# EAGLE board baseboard4 (EAGLE 4.15)
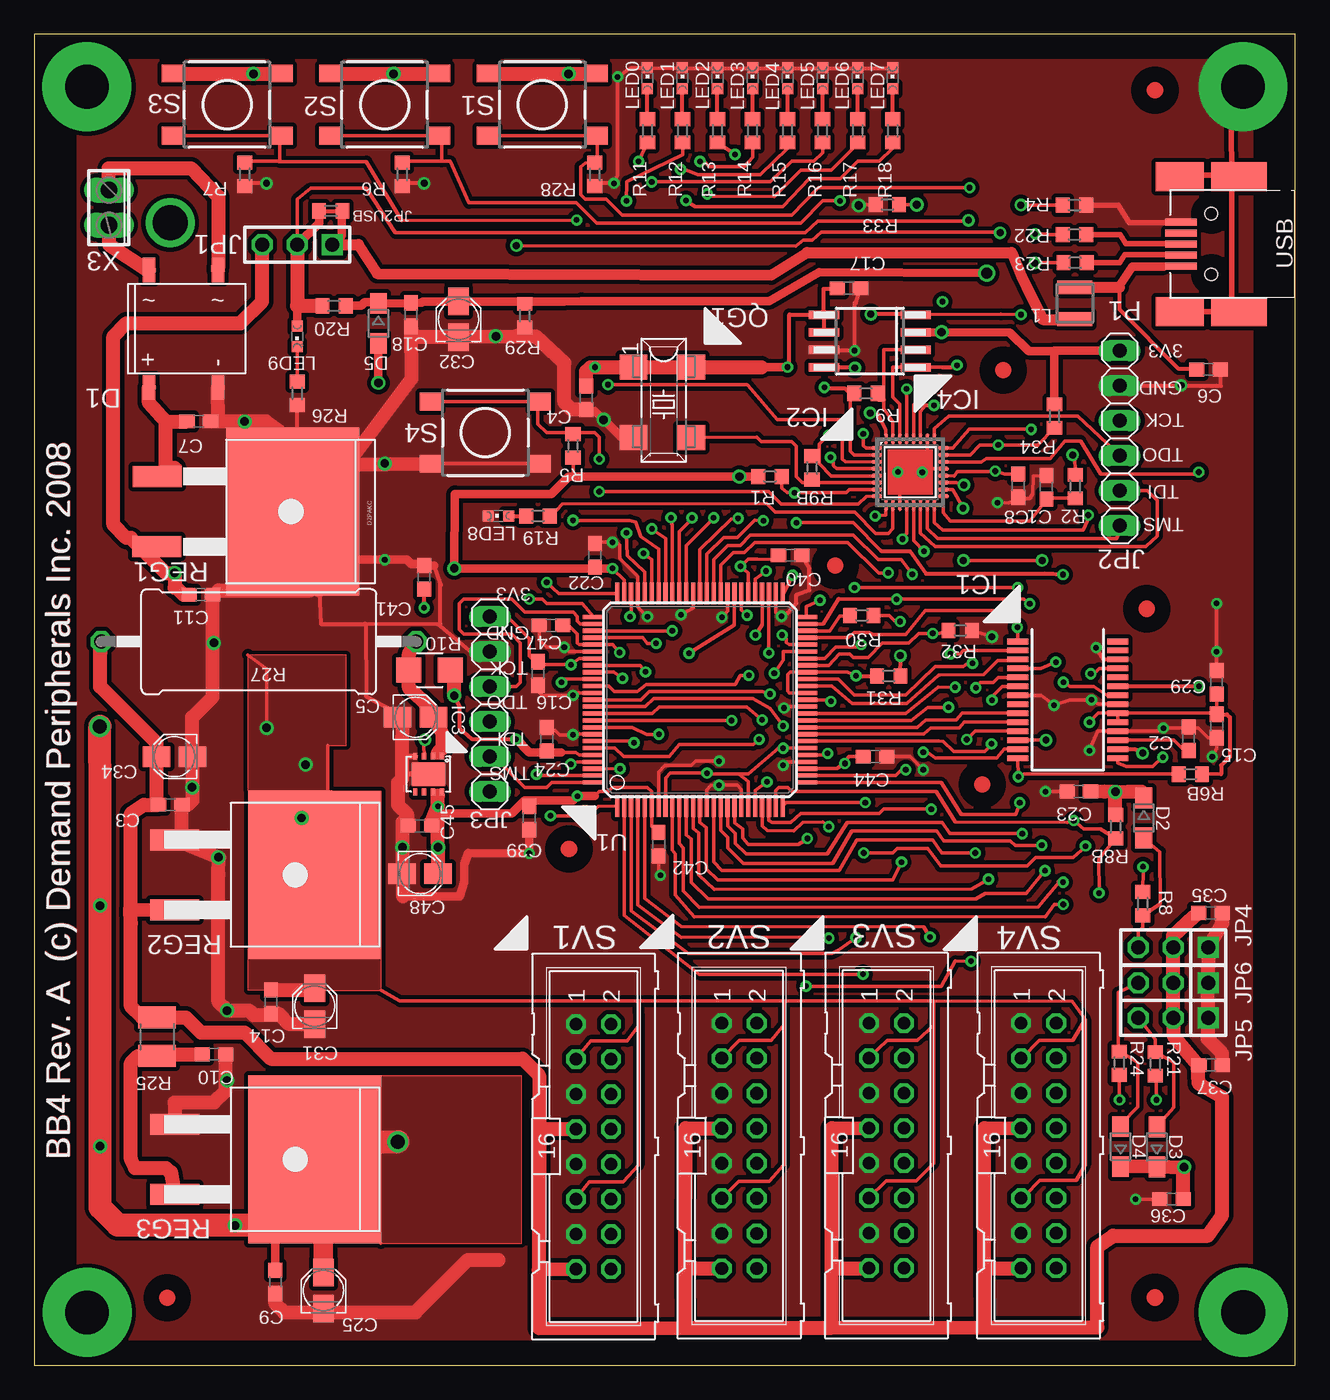
[diagram p3: board, top side]
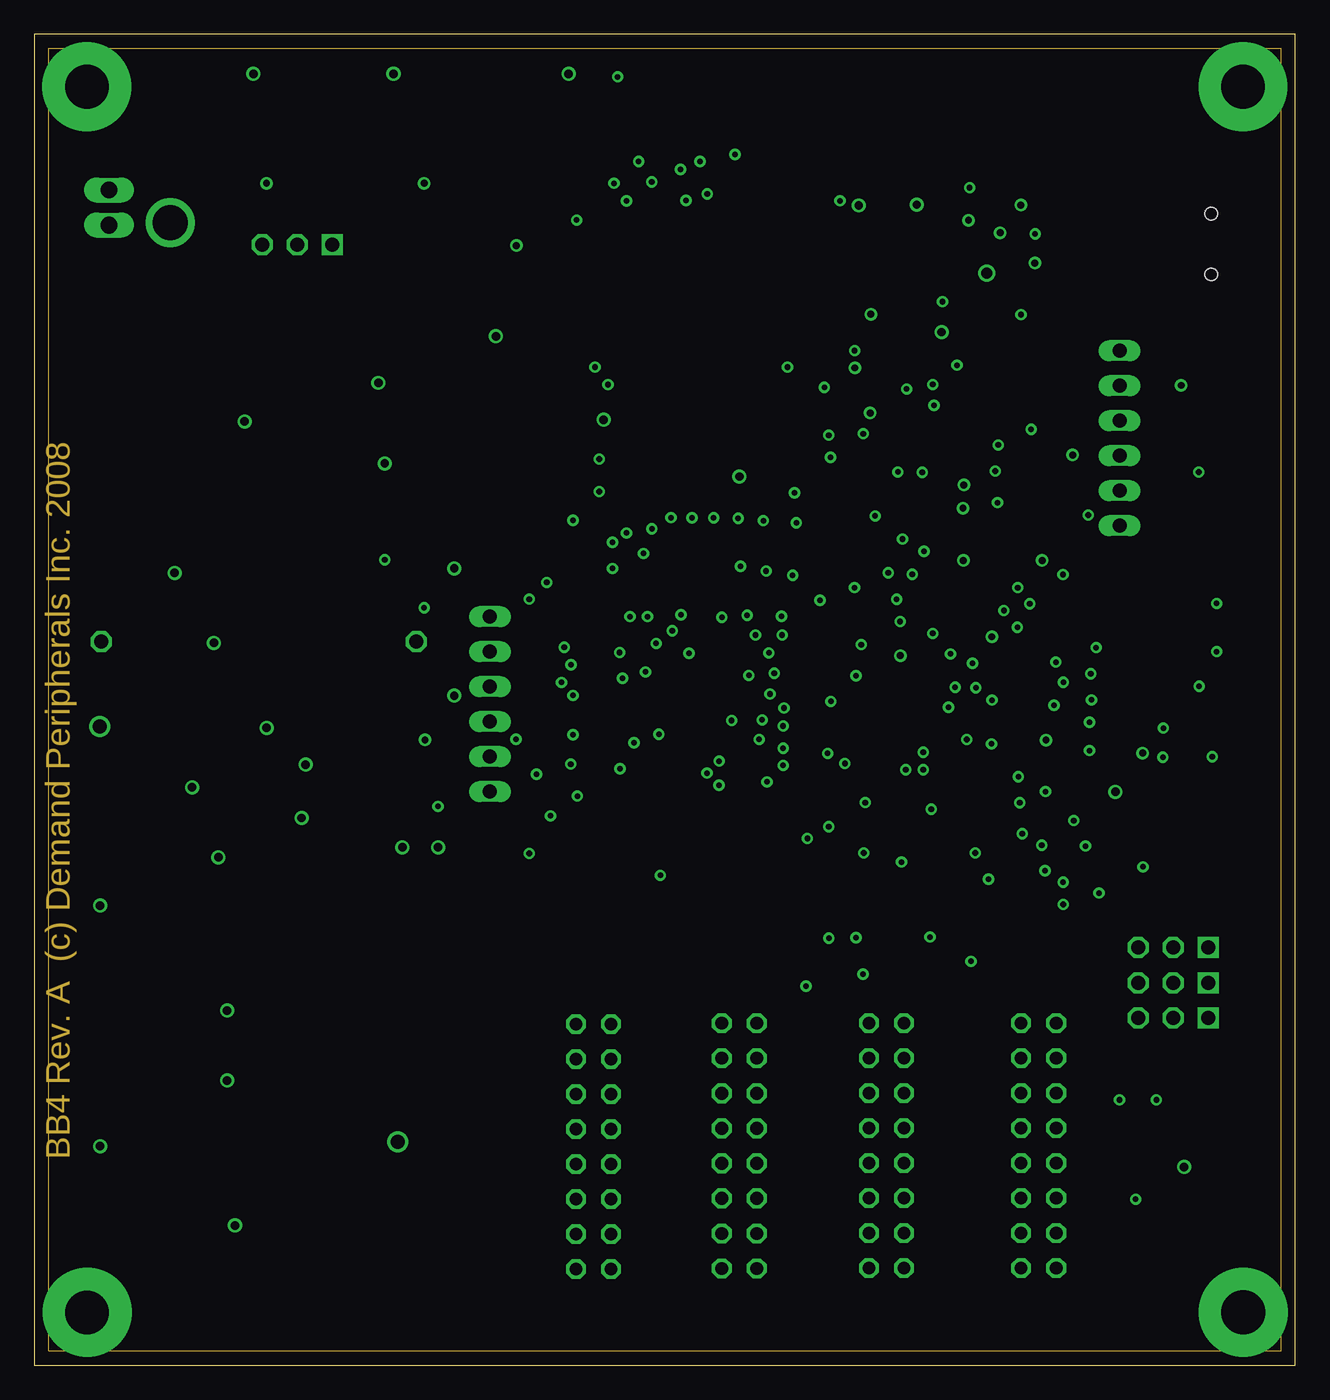
[diagram p4: board, inner layer $GND]
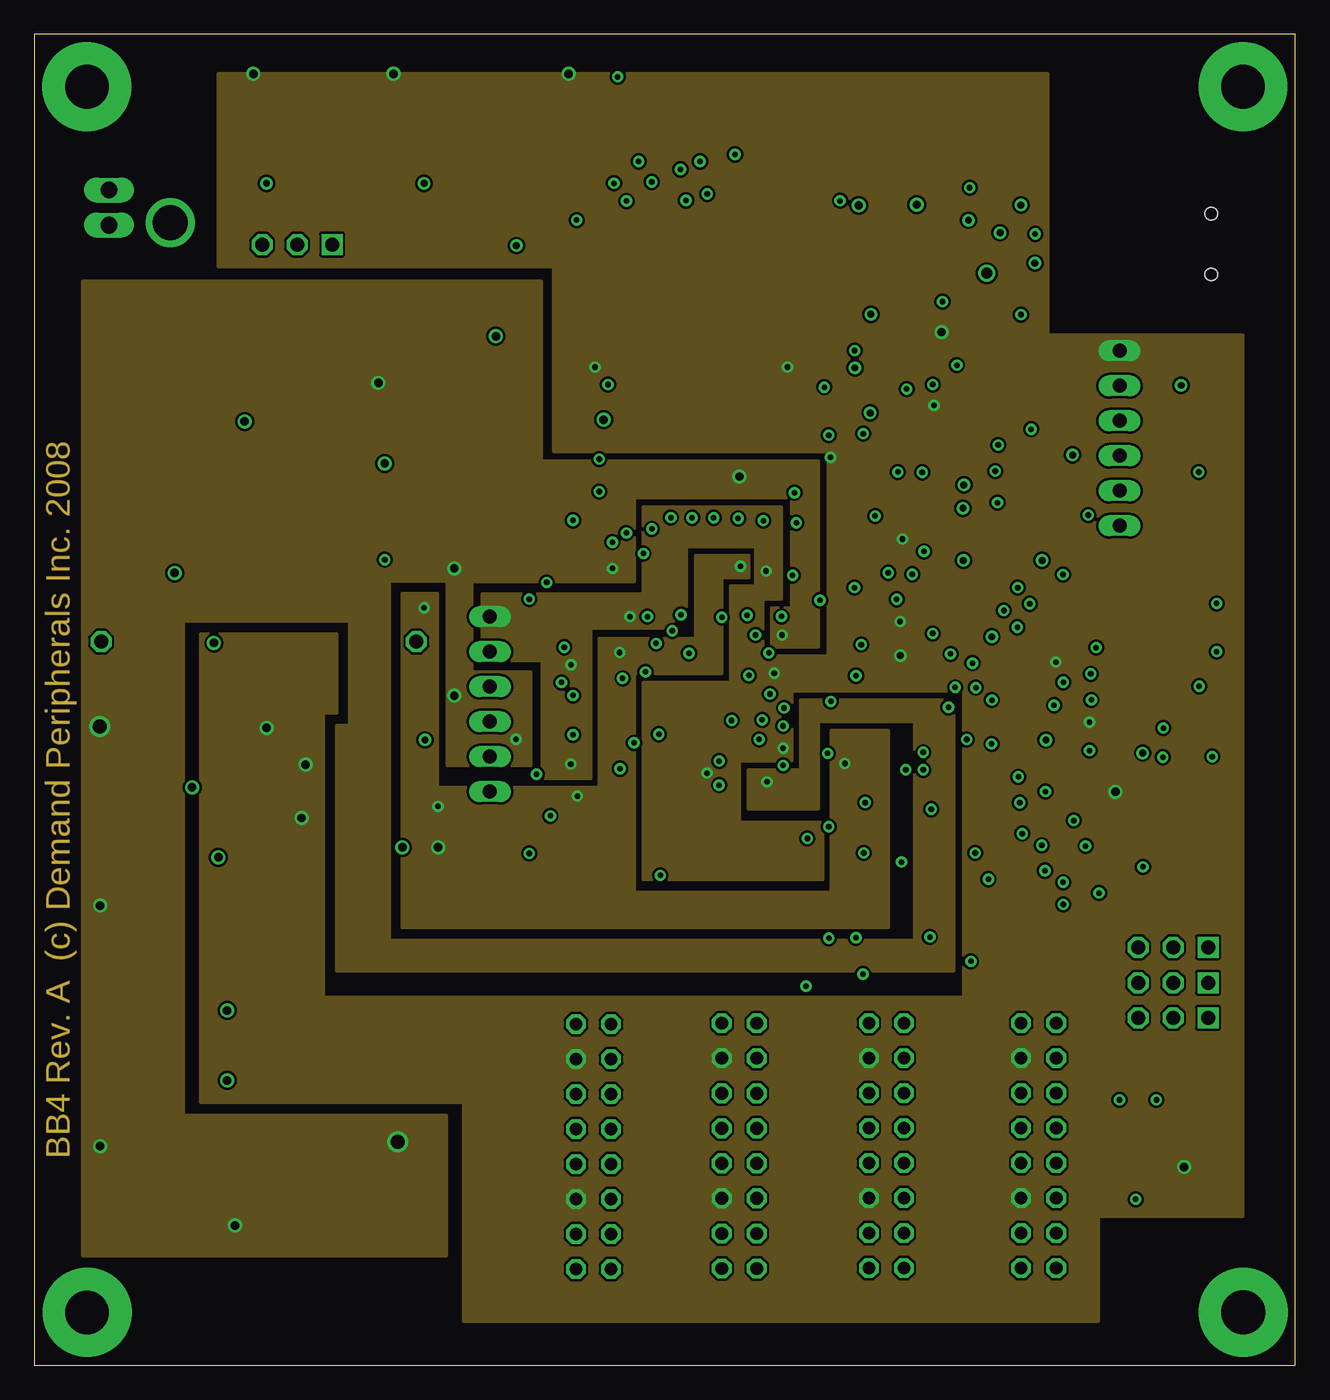
[diagram p5: board, inner layer Vxx]
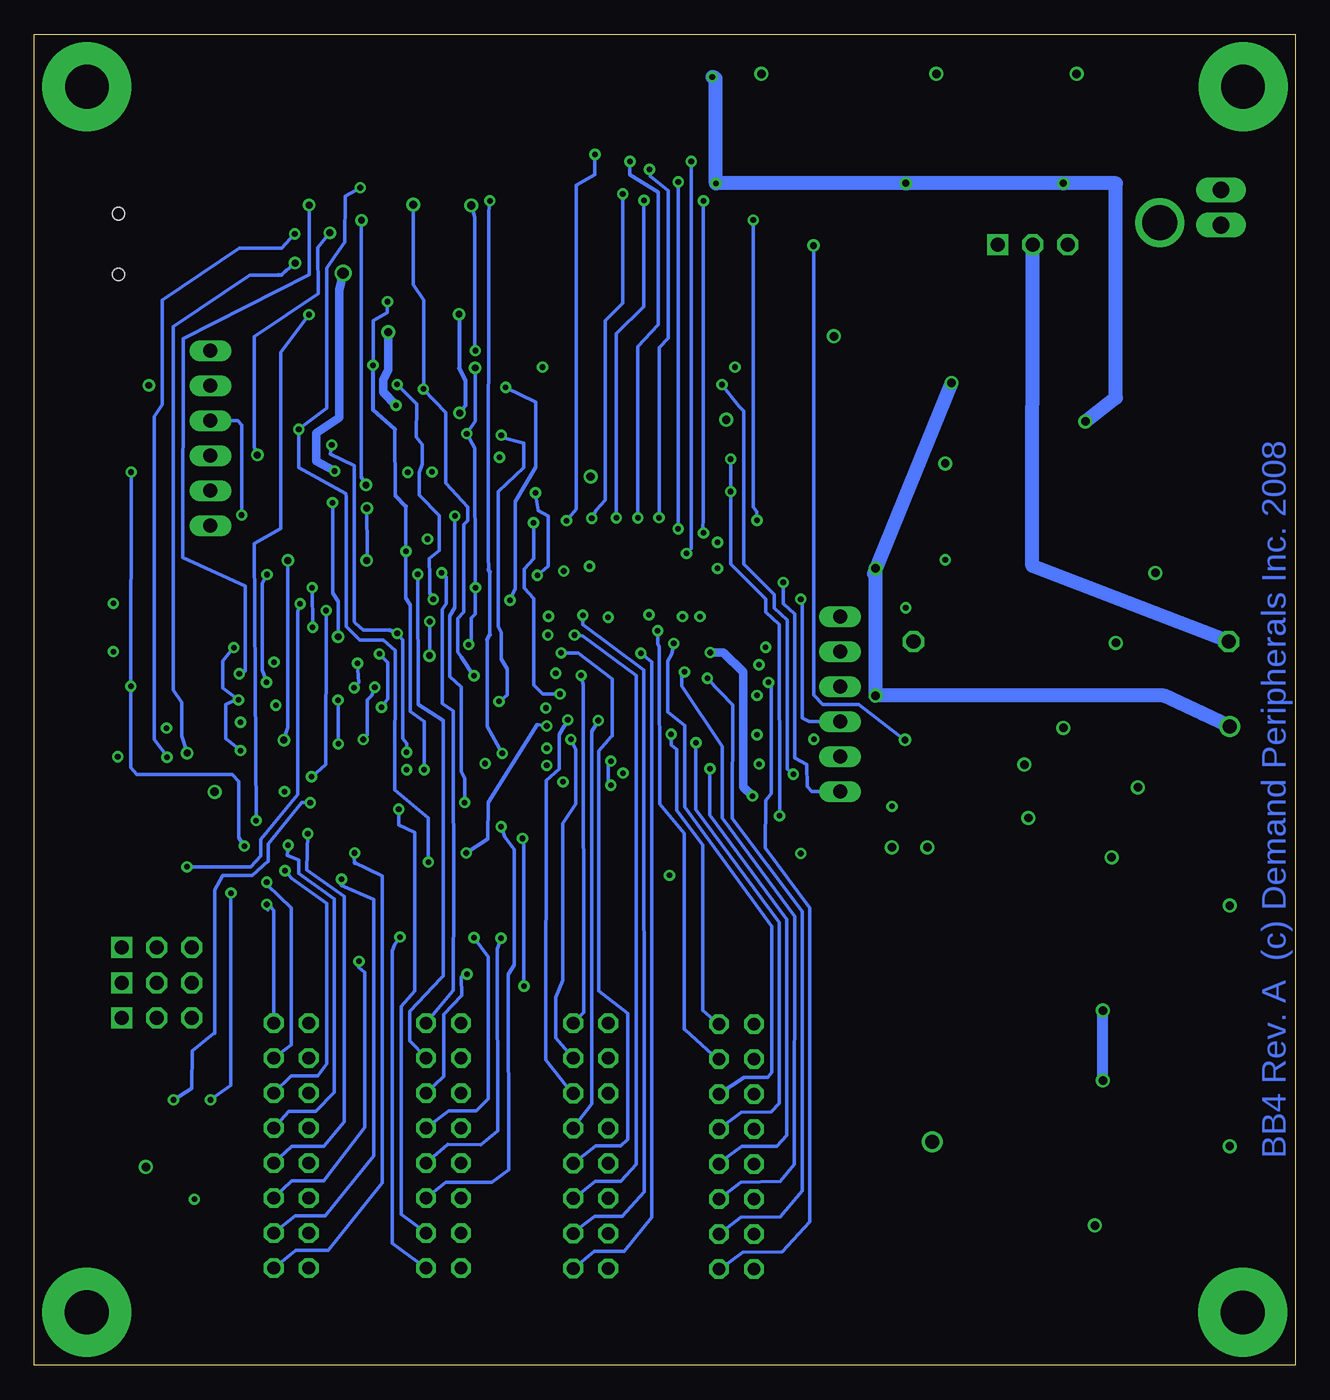
[diagram p6: board, bottom side, seen from below]

Size 91.44 x 96.52 mm. Coordinates in mm from the lower left corner, seen from the top.
Outline: 0,0 91.44,0 91.44,96.52 0,96.52 0,0
Copper layers (1*2+15*16): Top 0.035mm / dielectric 1.5mm / $GND 0.035mm / dielectric 0.15mm / Vxx 0.035mm / dielectric 0.2mm / Bottom 0.035mm
Design rules "M_BD2": minimum track width 10mil, minimum drill 16mil, track to track 7mil, track to pad 7mil, pad to pad 7mil, via to via 7mil, smd to smd 7mil, copper to edge 40mil, drill to drill 10mil, minimum pad ring 10mil, minimum via ring 8mil, stop-mask expansion 4mil, vias tented up to drill 0mil, thermal gap 10mil
tKeepout: area 0,0 to 3.2,96.5; area 88.3,0 to 91.4,96.5
bKeepout: area 0,0 to 3.2,96.5; area 88.3,0 to 91.4,96.5

## Footprints (pad centres in the part's own frame; a part is rotated, then mirrored left to right if it is on the bottom)
C0603 = smd 1.1 x 1: 1 -0.85,0; 2 0.85,0
PANASONIC_A = smd 2 x 1.5: + 1.3,0; - -1.3,0
DFS = smd 1.778 x 0.914: + -4,2.5; - -4,-2.5; ~1 4.5,2.5; ~2 4.5,-2.5
SOD323-W = smd 1.5 x 1.2: A 1.45,0; C -1.45,0
SSOP28C = smd 0.4 x 1.5: 1 -4.225,-3.625; 2 -3.575,-3.625; 3 -2.925,-3.625; 4 -2.275,-3.625; 5 -1.625,-3.625; 6 -0.975,-3.625; 7 -0.325,-3.625; 8 0.325,-3.625; 9 0.975,-3.625; 10 1.625,-3.625; 11 2.275,-3.625; 12 2.925,-3.625; 13 3.575,-3.625; 14 4.225,-3.625; 15 4.225,3.625; 16 3.575,3.625; 17 2.925,3.625; 18 2.275,3.625; 19 1.625,3.625; 20 0.975,3.625; 21 0.325,3.625; 22 -0.325,3.625; 23 -0.975,3.625; 24 -1.625,3.625; 25 -2.275,3.625; 26 -2.925,3.625; 27 -3.575,3.625; 28 -4.225,3.625
QFN32-ALT = smd 0.8 x 0.28: P$1 -2.41,1.75; P$2 -2.41,1.25; P$3 -2.41,0.75; P$4 -2.41,0.25; P$5 -2.41,-0.25; P$6 -2.41,-0.75; P$7 -2.41,-1.25; P$8 -2.41,-1.75; P$17 2.41,-1.75; P$18 2.41,-1.25; P$19 2.41,-0.75; P$20 2.41,-0.25; P$21 2.41,0.25; P$22 2.41,0.75; P$23 2.41,1.25; P$24 2.41,1.75 | smd 0.28 x 0.8: P$9 -1.75,-2.41; P$10 -1.25,-2.41; P$11 -0.75,-2.41; P$12 -0.25,-2.41; P$13 0.25,-2.41; P$14 0.75,-2.41; P$15 1.25,-2.41; P$16 1.75,-2.41; P$25 1.75,2.41; P$26 1.25,2.41; P$27 0.75,2.41; P$28 0.25,2.41; P$29 -0.25,2.41; P$30 -0.75,2.41; P$31 -1.25,2.41; P$32 -1.75,2.41
DFN-8B = smd 0.3 x 0.5: 1 -0.975,-1.3; 2 -0.325,-1.3; 3 0.325,-1.3; 4 0.975,-1.3; 5 0.975,1.3; 6 0.325,1.3; 7 -0.325,1.3; 8 -0.975,1.3 | smd 2.4 x 1.7: EP 0,0
SO-08M = smd 0.6 x 2.2: 1 -1.288,-3.578; 2 -0.018,-3.578; 3 1.252,-3.578; 4 2.522,-3.578; 5 2.522,3.083; 6 1.252,3.083; 7 -0.018,3.083; 8 -1.288,3.083
1X03 = drill 1.016 square: 1 -2.54,0 | drill 1.016 octagon: 2 0,0; 3 2.54,0
1X06 = drill 1.016 long: 1 -6.35,0; 2 -3.81,0; 3 -1.27,0; 4 1.27,0; 5 3.81,0; 6 6.35,0
R0603 = smd 1 x 1.1: 1 -0.85,0; 2 0.85,0
SM-NE29 = smd 1 x 2.54: 1 -1.15,0; 2 1.15,0
CHIPLED_0603 = smd 0.8 x 0.8: A 0,-0.75; C 0,0.75
MOLEXUSBRECEPT.0675031020 = smd 0.5 x 2.3: D+ 0,-6.2; D- 0.8,-6.2; GND -1.6,-6.2; ID -0.8,-6.2; VBUS 1.6,-6.2 | smd 2.1 x 4: PG -4.9,-2; PGC 4.9,-2 | smd 2.1 x 3.5: PGA -4.9,-6.3; PGB 4.9,-6.3 | hole 0.9: -2.2,-4; 2.2,-4
HC73 = smd 1.8 x 2: 1 0,-4.2; 2 5.1,-4.2; 3 5.1,0; 4 0,0
R1210W = smd 1.8 x 1.8: 1 -1.499,0; 2 1.499,0
R1210 = smd 1.6 x 2.7: 1 -1.4,0; 2 1.4,0
P0817/22 = drill 1.016 octagon: 1 -11.43,0; 2 11.43,0
D2PAKC = smd 12.192 x 9.652: GND 0,0 | smd 1.524 x 3.556: IP -2.54,-9.841; OP 2.54,-9.88
D2PAKB = smd 1.524 x 3.556: GND -2.54,-10.16; IP 2.54,-10.16 | smd 12.192 x 9.652: OUTPUT 0,0
DTSM-6 = smd 1.55 x 1.3: 1 -3.975,2.25; 2 3.975,2.25; 3 -3.975,-2.25; 4 3.975,-2.25
ML16 = drill 0.914 octagon: 1 -8.89,-1.27; 2 -8.89,1.27; 3 -6.35,-1.27; 4 -6.35,1.27; 5 -3.81,-1.27; 6 -3.81,1.27; 7 -1.27,-1.27; 8 -1.27,1.27; 9 1.27,-1.27; 10 1.27,1.27; 11 3.81,-1.27; 12 3.81,1.27; 13 6.35,-1.27; 14 6.35,1.27; 15 8.89,-1.27; 16 8.89,1.27
VQ100 = smd 1.6 x 0.3: P1 -7.7,6; P2 -7.7,5.5; P3 -7.7,5; P4 -7.7,4.5; P5 -7.7,4; P6 -7.7,3.5; P7 -7.7,3; P8 -7.7,2.5; P9 -7.7,2; P10 -7.7,1.5; P11 -7.7,1; P12 -7.7,0.5; P13 -7.7,0; P14 -7.7,-0.5; P15 -7.7,-1; P16 -7.7,-1.5; P17 -7.7,-2; P18 -7.7,-2.5; P19 -7.7,-3; P20 -7.7,-3.5; P21 -7.7,-4; P22 -7.7,-4.5; P23 -7.7,-5; P24 -7.7,-5.5; P25 -7.7,-6; P51 7.7,-6; P52 7.7,-5.5; P53 7.7,-5; P54 7.7,-4.5; P55 7.7,-4; P56 7.7,-3.5; P57 7.7,-3; P58 7.7,-2.5; P59 7.7,-2; P60 7.7,-1.5; P61 7.7,-1; P62 7.7,-0.5; P63 7.7,0; P64 7.7,0.5; P65 7.7,1; P66 7.7,1.5; P67 7.7,2; P68 7.7,2.5; P69 7.7,3; P70 7.7,3.5; P71 7.7,4; P72 7.7,4.5; P73 7.7,5; P74 7.7,5.5; P75 7.7,6 | smd 0.3 x 1.6: P26 -6,-7.7; P27 -5.5,-7.7; P28 -5,-7.7; P29 -4.5,-7.7; P30 -4,-7.7; P31 -3.5,-7.7; P32 -3,-7.7; P33 -2.5,-7.7; P34 -2,-7.7; P35 -1.5,-7.7; P36 -1,-7.7; P37 -0.5,-7.7; P38 0,-7.7; P39 0.5,-7.7; P40 1,-7.7; P41 1.5,-7.7; P42 2,-7.7; P43 2.5,-7.7; P44 3,-7.7; P45 3.5,-7.7; P46 4,-7.7; P47 4.5,-7.7; P48 5,-7.7; P49 5.5,-7.7; P50 6,-7.7; P76 6,7.7; P77 5.5,7.7; P78 5,7.7; P79 4.5,7.7; P80 4,7.7; P81 3.5,7.7; P82 3,7.7; P83 2.5,7.7; P84 2,7.7; P85 1.5,7.7; P86 1,7.7; P87 0.5,7.7; P88 0,7.7; P89 -0.5,7.7; P90 -1,7.7; P91 -1.5,7.7; P92 -2,7.7; P93 -2.5,7.7; P94 -3,7.7; P95 -3.5,7.7; P96 -4,7.7; P97 -4.5,7.7; P98 -5,7.7; P99 -5.5,7.7; P100 -6,7.7
2POL254 = drill 1.2 long: 1 -1.27,0; 2 1.27,0

## Placement (x,y rotation side)
C1  0.1uF  [C0603]  73.38,63.68 90 top
C2  0.033uF  [C0603]  83.69,45.43 90 top
C3  0.1uF  [C0603]  9.84,40.64 0 top
C4  0.1uF  [C0603]  40.01,70.17 270 top
C5  10uF  [PANASONIC_A]  27.62,46.99 0 top
C6  0.1uF  [C0603]  85.13,72.21 0 top
C7  0.1uF  [C0603]  11.91,68.45 0 top
C8  0.1uF  [C0603]  71.34,63.79 270 top
C9  0.1uF  [C0603]  17.46,6.03 270 top
C10  0.1uF  [C0603]  13.02,22.54 0 top
C11  0.1uF  [C0603]  12.06,55.88 0 top
C14  0.1uF  [C0603]  17.14,26.35 270 top
C15  0.1uF  [C0603]  85.72,46.35 270 top
C16  0.1uF  [C0603]  36.51,50.16 270 top
C17  0.1uF  [C0603]  59.05,78.11 0 top
C18  0.1uF  [C0603]  27.3,76.2 270 top
C22  0.1uF  [C0603]  40.64,58.74 90 top
C23  0.1uF  [C0603]  75.73,41.6 0 top
C24  0.1uF  [C0603]  37.15,45.4 90 top
C25  10uF  [PANASONIC_A]  20.95,5.4 90 top
C29  0.1uF  [C0603]  85.72,49.53 90 top
C31  10uF  [PANASONIC_A]  20.32,26.04 90 top
C32  10uF  [PANASONIC_A]  30.75,75.86 90 top
C34  10uF  [PANASONIC_A]  10.16,44.13 180 top
C35  0.1uF  [C0603]  85.29,32.79 0 top
C36  0.1uF  [C0603]  82.46,12.04 180 top
C37  0.1uF  [C0603]  85.29,21.76 0 top
C39  1.0uF  [C0603]  35.88,39.69 270 top
C40  0.1uF  [C0603]  54.8,58.74 0 top
C41  0.1uF  [C0603]  28.26,57.15 90 top
C42  0.1uF  [C0603]  45.26,37.78 270 top
C44  0.1uF  [C0603]  60.96,44.13 0 top
C45  0.1uF  [C0603]  27.95,39.12 180 top
C47  0.1uF  [C0603]  37.47,53.66 180 top
C48  10uF  [PANASONIC_A]  27.97,35.65 0 top
D1  L7805CD2T-TR  [DFS]  10.79,74.93 90 top
D2  SCHOTTKY  [SOD323-W]  80.44,39.69 270 top
D3  SCHOTTKY  [SOD323-W]  81.39,15.83 90 top
D4  SCHOTTKY  [SOD323-W]  78.76,15.84 90 top
D5  SD101AWS  [SOD323-W]  24.94,75.56 270 top
IC1  FT245RLSSOP-28  [SSOP28C]  74.93,48.26 270 top
IC2  XC2C32A-QFG32MOD_QFN32  [QFN32-ALT]  63.5,64.77 0 top
IC3  MCP1726  [DFN-8B]  28.57,42.86 180 top
IC4  AT45DB041D-SU  [SO-08M]  60.33,73.66 90 top
JP1  1x3 SIL  [1X03]  19.05,81.28 180 top
JP2  1x6 SIL  [1X06]  78.69,67.23 90 top
JP2USB  Cut4EXT  [R0603]  21.49,83.72 180 top
JP3  1x6 SIL  [1X06]  33.02,47.94 90 top
JP4  1x3 SIL  [1X03]  82.57,30.3 180 top
JP5  1x3 SIL  [1X03]  82.57,25.19 180 top
JP6  1x3 SIL  [1X03]  82.57,27.72 180 top
L1  Ferrite 500mA  [SM-NE29]  75.45,77.03 90 top
LED0  RED  [CHIPLED_0603]  44.45,93.34 0 top
LED1  RED  [CHIPLED_0603]  46.99,93.34 0 top
LED2  RED  [CHIPLED_0603]  49.53,93.34 0 top
LED3  RED  [CHIPLED_0603]  52.07,93.34 0 top
LED4  RED  [CHIPLED_0603]  54.61,93.34 0 top
LED5  RED  [CHIPLED_0603]  57.15,93.34 0 top
LED6  RED  [CHIPLED_0603]  59.69,93.34 0 top
LED7  RED  [CHIPLED_0603]  62.23,93.34 0 top
LED8  GREEN  [CHIPLED_0603]  33.66,61.59 90 top
LED9  RED  [CHIPLED_0603]  19.05,74.61 180 top
P1  USBRECEPTACLE  [MOLEXUSBRECEPT.0675031020]  89.34,81.32 270 top
QG1  50MHz  [HC73]  47.62,72.39 270 top
R1  330R  [R0603]  53.34,64.45 180 top
R2  1K0  [R0603]  75.46,63.73 270 top
R4  0R  [R0603]  75.41,84.14 180 top
R5  4K7  [R0603]  39.05,66.67 270 top
R6  10K  [R0603]  26.67,86.36 270 top
R6B  10K  [R0603]  83.82,42.86 0 top
R7  10K  [R0603]  15.24,86.36 270 top
R8  180R  [R0603]  80.37,33.47 270 top
R8B  4K7  [R0603]  78.4,39.04 90 top
R9  0R  [R0603]  60.3,70.48 180 top
R9B  0R  [R0603]  56.39,65.09 270 top
R10  1R0  [R1210W]  28.65,50.42 0 top
R11  180R  [R0603]  44.45,89.53 90 top
R12  180R  [R0603]  46.99,89.53 90 top
R13  180R  [R0603]  49.53,89.53 90 top
R14  180R  [R0603]  52.07,89.53 90 top
R15  180R  [R0603]  54.61,89.53 90 top
R16  180R  [R0603]  57.15,89.53 90 top
R17  180R  [R0603]  59.69,89.53 90 top
R18  180R  [R0603]  62.23,89.53 90 top
R19  180R  [R0603]  36.51,61.59 180 top
R20  1K5  [R0603]  21.73,76.83 0 top
R21  180R  [R0603]  81.28,21.84 90 top
R22  27R  [R0603]  75.41,82 180 top
R23  27R  [R0603]  75.46,79.97 0 top
R24  180R  [R0603]  78.66,21.89 90 top
R25  5R6 0.5W  [R1210]  8.89,23.81 270 top
R26  180R  [R0603]  19.05,70.48 90 top
R27  3R3 2W  [P0817/22]  16.27,52.48 0 top
R28  10K  [R0603]  40.64,86.36 270 top
R29  180R  [R0603]  35.56,76.12 90 top
R30  10K  [R0603]  59.99,54.38 0 top
R31  10K  [R0603]  61.95,49.99 0 top
R32  10K  [R0603]  67.13,53.29 0 top
R33  10K  [R0603]  61.85,84.18 0 top
R34  10K  [R0603]  73.96,68.83 90 top
REG1  [D2PAKC]  18.73,61.91 270 top
REG2  [D2PAKB]  20.32,35.56 270 top
REG3  [D2PAKB]  20.32,14.92 270 top
S1  DTSM-6  [DTSM-6]  36.83,91.44 0 top
S2  DTSM-6  [DTSM-6]  25.4,91.44 0 top
S3  DTSM-6  [DTSM-6]  13.97,91.44 0 top
S4  DTSM-6  [DTSM-6]  32.7,67.63 180 top
SV1  [ML16]  40.54,15.85 270 top
SV2  [ML16]  51.1,15.9 270 top
SV3  [ML16]  61.77,15.93 270 top
SV4  [ML16]  72.82,15.93 270 top
U1  XC3S100EVQ100  [VQ100]  48.26,48.26 90 top
U$3  [FIDUCIAL]  9.63,4.89 0 top
U$16  [FIDUCIAL]  81.26,4.9 0 top
U$23  [FIDUCIAL]  81.26,92.48 0 top
U$30  [FIDUCIAL]  38.76,37.44 0 top
U$31  [FIDUCIAL]  70.26,72.16 0 top
U$32  [FIDUCIAL]  58.06,57.99 0 top
U$34  [FIDUCIAL]  68.73,42.11 0 top
U$35  [FIDUCIAL]  80.67,54.86 0 top
U$37  [FIDUCIAL]  80.67,54.86 0 top
X3  2 pos  [2POL254]  5.4,83.96 270 top

## Tracks (layer width: path | path; a pad name or v marks a point on that pad's centre or on a via)
50MHZ
  Top 0.254: QG1.3 52.39,67.31 52.7,66.99 54.93,66.99 55.24,66.67 55.24,64.45 55.68,64.02 56.52,64.02 | 56.52,64.02 IC2.P$6 | 56.52,64.02 R9B.2
+1V2  (via drill 0.41, 0.61)
  Top 0.254: 40.64,41.27 40.96,41.59 41.59,41.59 41.91,41.91 44.45,41.91 44.76,41.6 U1.P6 44.76,40.33 44.77,40.32 44.77,39.05 45.19,38.63 C42.1 | 39.05,40.96 v39.37,41.27 | U1.P56 51.76,57.46 v51.2,57.94 51.77,58.45 52.43,58.45 54.23,58.45 | C47.1 38.73,53.66 39.37,53.02 39.37,52.39 39.5,52.26 U1.P80 41.92,52.28 42.46,51.67 v42.43,51.69 | U1.P28 58.18,43.26 v58.76,43.64 59.05,44.13 C44.1 | 29.57,41.56 IC3.8 29.52,41.56 | 29.55,40.51 v29.26,40.53 29.22,40.52 29.52,41.56 | 29.52,41.56 IC3.7
  Top 0.305: v29.26,40.53 29.84,40.01 | v28.26,54.93 C41.1 | 54.18,58.45 C40.1 54.23,58.45
  Top 0.61: v39.37,41.27 40.64,41.27 | 35.88,40.96 35.56,40.96 34.61,40.01 29.84,40.01 | 35.88,40.96 39.05,40.96 | 35.88,40.96 C39.1
  Top 1.016: C48.+ 29.24,39.98 29.21,40.01 C45.1 28.8,39.42 v29.26,40.53 29.26,41.31
  Bottom 0.61: v42.43,51.69 41.51,51.69 40.06,50.27 40.05,41.94 40.06,41.94 v39.37,41.27
  other vias: 29.27,37.55
  pour Vxx (no thermals): 29.2,55.98 26.67,55.98 26.67,31.75 61.91,31.75 61.91,46.04 57.78,46.04 57.78,34.29 43.5,34.29 43.5,50.16 49.85,50.16 49.85,57.12 51.8,57.12 51.8,58.74 47.94,58.74 47.94,52.7 40.96,52.7 40.96,41.91 29.2,41.91
+1V8  (via drill 0.41, 0.81)
  Top 0.254: IC2.P$20 66.7,64.49 66.92,64.82 69.22,64.82 v69.67,64.85 70.36,64.64 71.4,64.64 C8.1 71.37,64.57
  Top 0.61: 38.42,77.14 39.66,77.19 53.29,77.19 56.9,79.27 v69.06,79.2 | R20.2 22.68,76.81 | R20.2 22.53,76.83 | R20.2 23.7,76.83 23.95,77.09 24.92,77.09 D5.C 27.33,77.01 C18.1 28.09,77.06 28.17,77.14 30.76,77.14 C32.+ 35.59,77.14 | 35.59,77.14 R29.2 | 35.59,77.14 38.42,77.14 | 38.42,77.14 38.43,77.14
  Bottom 0.61: v69.06,79.2 69.33,77.99 69.33,68.75 71.02,67.6 70.99,65.58 v69.67,64.85
+2V5  (via drill 0.41, 0.6, 0.61, 1.02)
  Top 0: 25.12,8.84 35.33,8.82 35.33,21.01 25.09,21.01 25.12,8.84
  Top 0.254: U1.P21 52.26,41.68 v53.12,42.3 | 39.05,64.45 R5.2 | C22.1 42.12,57.89 v41.91,57.78 42.76,56.94 U1.P74 | REG3.OUTPUT 23.5,14.92 23.5,16.19 | 20.95,9.84 24.13,9.84 25.12,8.84 | U1.P46 54.74,52.26 54.53,52.41 54.53,52.69 v54.22,52.96 | 38.2,44.45 39.24,44.45 39.49,44.27 40.45,44.27 U1.P96
  Top 0.305: v30.44,48.55 30.82,47.71 30.81,47.73 30.81,46.23 31.7,45.41 v34.92,45.4 | 37.15,44.45 C24.1
  Top 0.61: 38.2,44.45 37.15,44.45 35.88,44.45 v34.92,45.4 | v41.91,57.78 v30.44,57.78 30.47,63.12 30.48,63.18 37.47,63.18 38.73,64.45 39.05,64.45 v51.12,64.45 R1.2 | 16.51,10.16 17.46,10.16 17.46,9.84 | 17.46,9.84 20.95,9.84 | 17.46,9.84 C9.1 | v24.94,71.25 D5.A
  Top 1.016: R10.2 30.43,50.14 v30.44,48.55
  Top 1.422: 20.95,9.84 C25.+
  Top 1.676: v4.75,46.32 4.76,40.96 v4.76,33.34 v4.76,15.88 4.76,11.43 6.03,10.16 16.51,10.16 | 23.5,16.19 v26.35,16.19
  Bottom 1.016: v4.75,46.32 6.75,47.26 9.54,48.55 v30.44,48.55 v30.44,57.78 30.56,57.4 v24.94,71.25
  other vias: 14.54,10.12
  pour Top (no thermals): 25.11,8.97 35.19,8.97 35.19,20.88 25.08,20.88
  pour Vxx (no thermals): 29.95,56.86 29.92,43.5 35.99,43.5 35.99,50.28 31.71,50.28 31.71,56.83 43.5,56.83 43.5,62.94 54.93,62.94 54.93,54.93 53.48,54.93 53.48,52.07 56.83,52.07 56.83,65.58 36.77,65.58 36.74,78.61 3.49,78.61 3.49,7.94 29.84,7.94 29.84,18.1 10.79,18.1 10.79,53.98 25.72,53.98 25.72,56.86
  pour Vxx (no thermals): 51.75,40.32 51.75,43.18 55.56,43.18 55.56,48.26 66.66,48.26 66.66,28.6 21.91,28.57 21.91,46.39 22.86,46.39 22.86,53.98 25.72,53.98 25.72,30.8 63.82,30.8 63.82,46.67 56.83,46.67 56.83,40.32
+3V3  (via drill 0.41, 0.5, 0.61)
  Top 0: 21.27,44.96 22.59,44.96 22.59,51.51 15.48,51.51 15.48,41.72 21.59,41.67 | 15.49,30.18 15.49,27.19 17.09,27.18 | 17.09,27.18 25.14,27.19 25.14,29.66 | C14.1 17.09,27.18
  Top 0.254: U1.P97 40.59,43.76 40.64,43.75 39.34,43.75 v38.89,43.6 | U1.P45 54.3,51.76 54.29,51.13 v53.65,50.18 | U1.P31 54.3,44.76 v54.29,44.74 | U1.P73 43.26,54.69 v43.18,54.29 | U1.P8 45.76,42.59 46.12,42.94 v48.77,42.94 48.94,42.89 51.1,42.89 | U1.P82 39.51,51.26 v38.9,50.8 36.83,50.8 | U1.P55 52.26,57.02 v53.06,57.59 | JP3.6 34.29,54.29 35.88,52.7 35.88,51.44 36.2,51.12 36.52,51.1 C16.1 | 21.27,44.96 21.27,35.24 20.32,34.29 | v16.83,46.23 16.83,50.48 15.48,51.51 | 78.42,47.31 78.44,47.28 IC1.20 78.56,46.86 78.74,46.67 78.7,46.63 IC1.19 | 78.42,47.31 85.41,47.31 | IC1.4 72.97,50.53 v74.07,50.99 | 78.42,47.31 77.15,47.31 v76.5,46.63 | 86.04,42.86 R6B.2 | 64.62,69.62 64.25,69.16 64.25,67.82 IC2.P$27 | IC2.P$12 63.25,61.53 63.25,60.3 v62.94,59.92 | 57.91,65.85 57.91,65.28 57.97,65.2 58.18,65.02 IC2.P$4 | v62.78,53.94 62.43,53.95 62,54.38 R30.2 | C4.1 39.69,70.8 | C15.1 C29.1 | 58.26,78.08 C17.1 | 53.97,44.76 51.77,42.89 51.1,42.89 | U1.P20 51.77,42.34 51.1,42.84 51.1,42.89 | 25.14,27.19 26.5,26.41 43.8,26.41 | 43.8,26.41 54.34,26.41 | 54.34,26.41 65.21,26.41 | 65.21,26.41 75.25,26.38 76.19,25.08 | 76.19,25.08 76.19,14.54 75.55,13.4 72.89,13.4 71.86,12.32 SV4.11 | 76.19,25.08 75.31,23.55 72.85,23.55 71.6,22.24 SV4.3 | SV3.11 61.77,13.37 63.94,13.37 65.21,14.65 65.21,24.63 | SV3.3 61.82,23.55 64.01,23.56 65.21,24.63 | SV2.11 51.07,13.34 53.27,13.34 54.34,14.54 54.34,24.52 | 54.34,24.52 54.34,24.97 54.34,26.39 54.34,26.41 | SV2.3 51.12,23.56 53.42,23.56 54.23,24.52 54.34,24.52 | SV1.11 40.25,13.28 42.71,13.28 43.8,14.54 43.8,24.63 | SV1.3 40.33,23.5 42.99,23.5 43.8,24.63 | 65.21,24.63 65.21,24.97 65.21,26.36 65.21,26.41
  Top 0.254: 43.8,26.41 43.8,26.33 43.8,24.63
  Top 0.305: 53.97,44.76 54.3,44.76 | 86.04,42.86 86.04,43.5 86.68,44.13 86.68,46.99 86.46,47.2 85.64,47.21 C15.1 85.68,47.12 85.41,47.31 | 17.78,93.66 18.1,93.66 | 64.62,69.62 v65.23,69.62 | v57.72,65.85 57.91,65.85 | IC4.5 57.23,78.08 58.26,78.08 | v54.61,72.39 54.74,72.52 54.74,76.2 57.3,76.2 IC4.5 | IC4.6 57.23,74.75 IC4.5 | R30.2 61.04,54.36 | v62.79,51.46 62.81,51.44 R31.2
  Top 0.406: 73.94,69.65 R34.2 | 73.94,73.56 73.94,73.58 | 64.08,74.91 IC4.3
  Top 0.61: 52.7,72.39 v54.61,72.39 | 73.94,73.58 JP2.6 | 73.94,69.65 73.94,73.56 72.08,73.56 70.74,74.91 v65.79,74.93 64.08,74.91
  Top 1.016: 52.7,72.39 QG1.4 QG1.1 v40.64,72.39 40.32,72.39 40.01,72.07 C4.1 | 20.32,34.29 23.18,31.43 | S3.2 17.81,93.69 17.78,93.66 | S1.2 38.76,93.69 v38.73,93.66 33.02,93.66 32.99,93.69 S1.1 | 29.21,93.66 29.24,93.69 S2.2 26.06,93.69 v26.04,93.66 21.27,93.66 21.3,93.69 S2.1 | 18.1,93.66 S3.2 | 17.78,93.66 17.92,93.66 S3.2 | 17.78,93.66 v15.88,93.66 10.02,93.66 S3.1 | D4.C 81.45,14.4 D3.C 83.3,14.31 | 83.3,14.31 v83.36,14.37 | v78.39,41.59 78.4,41.57 77.58,41.59 76.55,41.59 C23.2 | R8B.2 78.38,39.93 v78.39,41.59 | v78.39,41.59 79.32,41.59 80.27,41.59 D2.C | C14.1 20.32,27.2 C31.+ | C36.1 83.29,12.07 83.3,14.31
  Bottom 0.254: v62.78,53.94 62.79,53.75 v62.79,51.46
  Bottom 0.61: 65.79,75.03 v65.79,74.93 65.79,72.16 66.14,71.48 66.14,70.56 65.25,69.62 v65.23,69.62
  other vias: 19.37,39.69 19.66,43.56
  pour Top (no thermals): 21.27,41.59 21.27,45.09 22.47,45.09 22.47,51.38 15.61,51.38 15.61,41.59
  pour Top (no thermals): 15.62,27.3 15.62,29.53 25.02,29.53 25.02,27.3
  pour Vxx (no thermals): 21.91,53.02 12.06,53.02 12.06,19.05 31.11,19.05 31.11,3.17 77.15,3.17 77.15,10.79 87.63,10.79 87.63,74.7 73.48,74.7 73.48,93.66 13.34,93.66 13.31,79.69 37.64,79.69 37.67,66.28 57.57,66.28 57.54,51.44 52.82,51.44 52.82,55.56 54.17,55.56 54.17,62.23 44.13,62.23 44.13,55.92 32.49,55.92 32.49,51.12 36.83,51.12 36.83,42.55 40.32,42.55 40.32,53.47 47.26,53.47 47.26,59.37 52.31,59.37 52.31,56.52 50.48,56.52 50.48,49.53 44.13,49.53 44.13,35.24 57.15,35.24 57.15,39.37 51.12,39.37 51.12,43.81 54.93,43.81 54.93,48.9 67.39,48.9 67.39,26.67 20.95,26.67 20.95,47.31 21.91,47.31
+5V_EXT  (via drill 0.61)
  Top 0.254: 10.16,56.2 10.16,56.4 10.28,56.4
  Top 0.61: REG1.OP 7.62,59.37 6.99,60.01
  Top 1.016: C11.1 10.79,55.88 10.28,56.4 | JP1.3 16.51,77.15 14.92,75.56 6.67,75.56 5.71,74.61 5.71,60.96 6.67,60.01 6.99,60.01 9.53,57.47 v10.16,57.47 10.16,56.4
+5V_USB
  Top 0.406: 75.34,75.84 L1.1
  Top 0.61: JP1.1 22.28,81.92 22.28,82.93 22.33,83.67 JP2USB.1
  Top 0.813: JP1.1 23.48,81.28 24.85,79.17 53.44,79.07 56.03,80.71 70.87,80.71 71.56,78.99 71.92,78.26 73.11,75.84 75.34,75.84
AGND  (via drill 0.41, 0.5)
  Top 0.254: IC1.25 77.2,50.53 76.83,50.16 v76.59,50.14 | R4.2 74.57,84.15 v71.53,84.15
  Bottom 0.254: v71.53,84.15 71.53,79.1 80.67,74.47 80.68,58.59 76.16,56.5 76.17,50.34 v76.59,50.14 76.17,50.37
CCLK  (via drill 0.41)
  Top 0.254: v57.28,70.93 57.61,70.85 | U1.P50 55.96,55.01 v56.96,55.47 | 59.16,70.1 59.16,66.34 59.16,66.28 59.44,66.02 IC2.P$2
  Top 0.305: v57.28,70.93 57.34,70.87 58.75,70.87 59.16,70.46 59.16,70.1 59.44,70.1 R9.2
  Bottom 0.254: 57.28,70.92 55.09,69.85 55.09,65.13 56.57,62.64 56.57,56.33 56.99,55.44 v56.96,55.47
  Bottom 0.305: 57.28,70.92 v57.28,70.93
CCLK_FLASH
  Top 0.254: IC2.P$31 62.26,68.45 61.57,69.39 61.59,69.41 61.59,70 61.59,73.66 63.82,73.66
  Top 0.305: 61.59,70 61.21,70 R9.1 | 63.82,73.66 IC4.2 63.88,73.66 63.82,73.66
D0  (via drill 0.41, 0.5 pad 0.25)
  Top 0.254: U1.P44 57.29,51.26 58.1,52.07 59.69,52.07 v59.96,52.26 | v60.1,67.56 60.1,66.69 60.33,66.52 IC2.P$1 | IC1.1 71.31,53.16 v71.27,53.52 | v59.47,56.4 v71.3,56.4
  Top 0.305: IC4.8 57.32,72.37 57.33,72.36 v59.49,72.34
  Bottom 0.254: v59.96,52.26 59.78,52.61 59.78,54.2 59.5,54.49 v59.47,56.4 59.5,66.51 v60.1,67.56 59.49,68.48 v59.49,72.34 | v71.3,56.4 v71.27,53.52
D1  (via drill 0.41)
  Top 0.254: v68.02,50.91 67.64,50.89 67.35,50.66 65.33,50.66 63.2,48.62 59.44,48.62 58.29,49.76 U1.P41 | IC1.5 69.89,49.88 69.53,49.53 68.58,49.53 v68.26,49.14
  Bottom 0.254: v68.26,49.14 67.94,49.53 v68.02,50.91
D2
  Top 0.254: IC1.3 71.19,51.19 71.12,51.12 69.85,51.12 68.83,50.08 65.66,50.07 65.58,50.06 63.25,47.98 59.31,47.98 57.81,49.25 U1.P40
D3  (via drill 0.41)
  Top 0.254: U1.P36 63.2,47.26 65.55,49.19 v66.76,49.16 | IC1.11 68.21,45.98 v67.6,45.38
  Bottom 0.254: v66.76,49.16 66.99,48.58 67.31,48.26 67.31,45.72 v67.6,45.38
D4  (via drill 0.41)
  Top 0.254: U1.P35 63.59,46.76 64.77,47.71 v66.28,47.71 | IC1.2 68.81,51.84 68.76,51.84 67.36,51.84 67.13,51.59 v66.43,51.59
  Bottom 0.254: v66.28,47.71 65.81,48.31 65.81,50.97 v66.43,51.59
D5
  Top 0.254: U1.P34 64.02,46.26 64.62,46.79 66.84,46.79 67.29,47.28 IC1.9
D6
  Top 0.254: U1.P33 64.49,45.76 64.99,46.2 67.06,46.2 67.44,46.63 IC1.10
D7  (via drill 0.41)
  Top 0.254: U1.P32 65.58,45.26 65.9,45.23 66.67,44.52 68.91,44.52 v69.41,45.06 | IC1.6 70.19,49.23 69.22,48.26 v69.43,48.23
  Bottom 0.254: v69.41,45.06 v69.43,48.23
DONEFPGA  (via drill 0.41)
  Top 0.254: IC2.P$7 59.08,63.52 58.86,63.28 v55.12,63.28 54.58,63.28 54.19,63.6 R1.1 | U1.P51 54.26,55.86 54.98,57.26 v54.98,57.29
  Bottom 0.254: v55.12,63.28 54.93,61.98 54.17,61.59 54.17,57.95 v54.98,57.28 v54.98,57.29
GND  (via drill 0.41, 0.5, 0.5 pad 0.81, 0.6, 0.61, 3.17 pad 6.45)
  Top 0.254: U1.P87 39.23,48.76 v39.05,48.58 36.83,48.58 36.51,48.9 C16.2 | 28.6,65.38 S4.2 | 28.6,65.38 S4.1 | 28.6,65.38 28.57,65.41 | C29.2 85.41,50.16 | 56.19,57.8 C40.2 | U1.P81 38.73,51.76 v38.42,52.07 37.15,52.07 36.62,52.6 C47.2 | C42.2 45.26,35.73 v45.39,35.53 | U1.P7 45.26,43.04 45.72,43.5 47.62,43.5 47.94,43.81 v49.65,43.81 | 26.64,43.76 26.67,43.81 | C22.2 40.64,59.69 v41.91,59.69 42.23,59.69 42.44,59.47 42.44,58.52 43.76,57.2 U1.P72 43.76,54.98 v44.45,54.29 | U1.P59 50.26,54.7 v49.84,54.24 | U1.P52 53.76,54.57 54.18,54.26 v54.17,54.31 54.59,54.51 54.58,54.53 | U1.P37 54.43,47.76 v54.36,47.66 | U1.P29 54.55,43.76 v54.29,43.5 | U1.P19 51.26,41.77 50.95,42.06 v49.65,42.06 49.03,42.06 48.76,41.71 48.76,40.58 48.76,40.57 U1.P14 | U1.P93 39.09,45.76 v39.05,45.72 38.1,45.72 37.78,46.04 37.15,46.04 C24.2 | 13.87,19.9 13.87,20.54 v13.97,20.64 | C25.- 20.93,4.1 20.64,3.81 | v64.45,43.18 63.5,44.13 C44.2 | IC1.26 77.51,51.19 v76.99,52.05 | IC1.7 73.02,48.59 v73.94,47.87 75.07,48.25 v76.65,48.25 77.16,47.94 IC1.21 | v76.5,44.58 77.1,45.98 IC1.18 81.55,45.98 v81.86,46.2 82.59,46.22 83.44,46.2 C2.2 | v42.02,85.72 42.29,86.33 | IC2.P$11 62.76,63.33 | R32.2 68.31,53.19 v69.42,52.83 | v85.41,44.13 85.72,44.73 C15.2 85.06,45.52 84.38,46.2 83.77,46.2 | IC2.P$21 65.94,65.02 65.25,65.02 64.41,64.8 v64.38,64.76 64.39,64.8 64.75,66.06 64.75,67.28 IC2.P$26 | C1.2 73.53,64.54 72.42,64.49 72.4,63.23 72.19,62.87 71.37,62.84 C8.2 71.37,62.87 70.61,62.53 v69.84,62.56 | v59.77,84.12 60.2,84.18 R33.1 | v79.85,12.03 v79.86,12.03 C36.2 | v73.31,41.6 73.28,41.59 C23.1 | U1.P64 47.76,54.91 46.91,54.44 v46.88,54.43
  Top 0.305: 24.02,53.78 24.04,48.5 26.59,47.14 | 85.72,50.8 v85.72,51.75 v85.72,55.24 | 29.45,56.65 29,58 | 29.45,56.65 29.48,56.58 | C29.2 85.72,50.8 | 85.72,50.8 85.41,50.48 | 54.51,54.46 54.58,54.53 55.24,55.24 55.24,55.88 56.19,56.21 56.19,57.8 | 42.29,86.33 v42.29,93.45 43.18,94.06 43.3,94.09 44.48,94.11 LED0.C LED1.C | R28.2 40.85,85.72 v42.02,85.72 | 26.67,85.41 26.99,85.72 v28.26,85.72 | 15.24,85.41 15.56,85.72 v16.83,85.72 | R26.1 19.05,67.63 17.78,67.7 | REG1.GND 19.37,62.55 20.32,62.55 | 62.76,63.33 v62.61,64.78 | 59.5,73.61 59.51,73.61 | 59.5,73.61 v59.47,73.58 59.47,77.04 59.56,77.04 59.89,78 C17.2 | IC4.7 57.28,73.61 59.5,73.61 | JP2.5 86.03,71.04 86.03,72.01 C6.2 | JP3.5 32.89,51.79 31.52,51.84 29.23,53.75 | 20.64,56.2 20.78,53.77 23.93,53.77 24.02,53.78 | 24.02,53.78 29.44,53.77 29.44,56.64 29.45,56.65 | LED1.C | LED2.C | LED1.C LED2.C | 52.09,94.08 LED3.C | LED2.C 52.09,94.08 | 54.66,94.08 LED4.C | 52.09,94.08 54.66,94.08 | 57.23,94.08 LED5.C | 54.66,94.08 57.23,94.08 | 59.72,94.08 LED6.C | 57.23,94.08 59.72,94.08 | LED7.C 62.2,94.08 59.72,94.08
  Top 0.406: 26.64,44.13 26.67,44.13 26.7,44.16 IC3.4 | 26.64,42.86 IC3.EP | R4.1 78.59,84.12 79.38,82.88 81.99,82.88 P1.GND
  Top 0.61: QG1.2 42.55,67.31 v41.27,68.58 40.64,69.22 40.01,69.22 C4.2 | 29,58 C41.2 | 28.26,58.1 27.3,58.1 26.99,58.42 v25.4,58.42 20.64,58.42 | C39.2 v35.88,37.11 31.46,37.13 31.17,36.31 31.17,35.04 30.85,34.01 26.72,34.01
  Top 1.016: C10.2 13.87,19.9 13.02,19.05 10.16,19.05 10.2,19.01 REG3.GND | D1.- 13.32,68.47 13.34,68.58 C7.2 v15.24,68.45 16.78,68.45 17.78,67.7 17.78,65.09 20.16,62.71 | 20.16,62.71 | 20.32,62.55 20.16,62.71 | 10.69,38.31 C3.2 11.11,40.64 11.46,40.99 C34.- 11.43,44.13 11.43,46.99 12.91,48.48 C11.2 13.02,55.88 13.34,56.2 20,56.2 20.28,56.48 20.28,56.52 20.32,56.52 20.64,56.2 | REG2.GND 13.38,36.79 13.34,35.56 13.34,26.35 v13.97,25.72 15.56,25.72 15.88,25.4 17.78,25.4 | 26.99,40.01 C45.2 | 26.99,40.01 26.35,40.64 26.35,42.23 26.64,42.52 26.64,42.86 26.64,43.76 26.64,44.13 26.64,44.8 26.67,46.67 C5.- 26.59,47.14 | 26.99,40.01 26.99,39.69 26.67,39.37 v26.69,37.56 26.67,37.47 | C48.- 26.67,37.15 26.67,37.47 | 20.16,62.71 | 22.68,65.33 22.83,65.38 20.16,62.71 | 22.68,65.33 28.6,65.38 | C4.2 38.95,69.32 38.42,69.85 38.42,72.71 | 27.3,75.25 C18.2 | 27.3,75.25 27.36,71.56 22.68,65.33 | 27.3,75.25 27.3,74.93 27.67,74.61 30.11,74.61 | 30.11,74.61 C32.- | 26.67,37.47 26.72,34.01 | 17.46,5.08 17.46,4.45 18.1,3.81 20.64,3.81 27.62,3.81 31.43,7.62 33.66,7.62 | 20.16,62.71 20,62.55 | 20.16,62.71 | 17.78,25.4 18.41,24.77 20.32,24.77 | C14.2 17.68,25.5 17.78,25.4 | 30.11,74.61 35,74.62 | 35,74.62 36.32,74.62 38.43,72.69 | 35,74.62 35,74.65 | C37.2 86.13,22.59 85.08,23.67 85.14,25.21 JP5.1 85.08,27.79 85.2,30.28 85.17,30.32 85.17,30.33 86.14,32.05 C35.2
  Bottom 0.254: v49.65,43.81 49.83,43.79 49.83,42.08 49.85,42.12 v49.65,42.06 | v69.42,52.83 69.42,55.4 69.83,56.01 69.83,62.2 v69.84,62.56 | v59.77,84.12 59.51,83.26 59.51,73.46 v59.47,73.58 | 76.91,52.15 77.8,51.08 77.8,49.1 v76.65,48.25 76.9,48.24 77.57,47.92 77.58,45.44 76.45,44.55
  Bottom 0.813: v13.97,20.64 v13.97,25.72
  Bottom 1.016: v15.24,68.45 13.02,70.17 13.02,85.72 v16.83,85.72 v28.26,85.72 v42.02,85.72 42.05,93.34 v42.29,93.45
  other vias: 87.64,92.72 11.43,41.91 13.02,52.39 13.34,36.83 33.46,74.63 25.4,65.41 83.15,71.07
  pour Top (isolate 0.305, no thermals): 3.17,94.61 88.26,94.62 88.25,1.91 3.17,1.91
GPIO_0/VS0  (via drill 0.41)
  Top 0.254: U1.P49 56.94,53.76 57.21,53.76 58.33,55.6 58.33,55.55 v62.52,55.55 71.73,55.55 v72.17,55.22 | IC2.P$28 63.75,69.65 65.15,71.14 v65.14,71.13 | R8.1 80.37,34.17 v80.39,36.14
  Bottom 0.254: v65.14,71.13 63.77,69.76 63.73,69.72 63.75,67.32 63.32,66.76 63.32,65.37 63.54,64.73 63.54,63.1 62.08,61.62 62.08,59.08 62.8,58.51 62.79,57.12 62.79,56.02 v62.52,55.55 | v72.17,55.22 72.34,54.66 72.36,52.25 72.36,51.69 72.36,41.41 75.02,38.12 75.02,36.93 75.78,36.14 80.45,36.14 v80.39,36.14
GPIO_1  (via drill 0.41, 0.5 pad 0.25)
  Top 0.254: U1.P24 53.76,41.7 53.98,41.91 54.61,41.91 54.93,41.59 65.41,41.61 65.4,41.6 66.78,39.39 74.89,39.38 75.45,39.45 v75.36,39.5 76.1,38.9 77.31,38.9 77.29,38.91 78.41,38.21 R8B.1 78.42,38.21 77.19,36.7 v77.2,34.24 | IC4.4 70.08,76.22 v71.54,76.2 | IC2.P$32 61.75,67.87 61.11,69.06 v60.6,69.06 | R24.1 78.68,21.02 v78.68,19.23
  Top 0.305: IC4.4 63.82,76.2 63.88,76.2 IC4.4 | IC4.4 63.93,76.12 | IC4.4 64.08,76.22 v60.66,76.22
  Bottom 0.254: v75.36,39.5 75.51,59.59 73.58,60.67 73.57,73.46 73.56,73.53 71.55,76.17 v71.54,76.2 | v77.2,34.24 77.2,20.28 v78.68,19.23
  Bottom 0.305: v60.6,69.06 60.2,69.62 60.2,71.4 60.66,72.31 v60.66,76.22
GPIO_2  (via drill 0.41)
  Top 0.254: R21.1 81.36,20.99 v81.36,19.23 | U1.P26 65.75,42.25 67.21,39.93 71.15,39.93 71.48,40.8 v71.45,40.79
  Bottom 0.254: v81.36,19.23 80.03,20.07 80,22.77 78.44,24.06 78.37,24.07 78.36,34.47 77.79,35.52 75.64,35.51 74.48,36.58 | v71.45,40.79 72.07,40.81 74.48,37.8 74.48,36.58 | 74.48,36.58 74.48,36.53
HSWAP  (via drill 0.41)
  Top 0.254: v41.59,71.12 51.67,71.13 51.71,71.1 53.88,68.58 58.59,68.58 58.59,65.71 58.78,65.52 IC2.P$3 | U1.P99 36.62,42.76 v36.41,42.86
  Bottom 0.254: v41.59,71.12 40.32,69.53 40.01,69.22 40.01,58.1 37.78,55.88 37.78,54.93 36.85,54.05 36.85,43.26 v36.41,42.86
INIT_B  (via drill 0.41)
  Top 0.254: IC2.P$9 61.75,61.67 v60.96,61.59 | U1.P25 54.52,40.81 54.53,40.81 60.11,40.82 v60.25,40.8
  Bottom 0.254: v60.96,61.59 60.96,54.96 61.34,54.34 61.35,49.96 60.5,49.2 60.5,43.06 60.25,42.55 v60.25,40.8
IP  (via drill 0.41)
  Top 0.254: IC2.P$24 66.59,66.52 67.8,67.88 v72.28,67.88 | U1.P13 48.26,39.37 48.72,39 48.72,35.97 49.54,35.2 62.24,35.2 v62.88,36.49 | S1.4 S1.3 | 40.46,87.22 39.95,87.2 39.6,86.94 39.6,84.89 39.93,84.56 41.48,84.56 42.62,83.43 54.93,83.43 56.83,85.41 67.79,85.39 v67.82,85.41 | R28.1 40.79,87.58 40.79,88.59
  Top 0.305: 40.46,87.22 R28.1 | S1.4 40.84,89.08 40.79,88.59
  Bottom 0.254: v62.88,36.49 62.88,39.7 65.3,41.73 65.28,51.84 66.17,52.58 67.84,52.58 68.83,53.57 68.83,62.99 68.87,63.21 72.28,65.11 v72.28,67.88 70.26,69.42 70.26,79.55 69.65,80.47 68.94,81.46 68.91,84.78 67.79,85.39 v67.82,85.41
JPA3  (via drill 0.41)
  Top 0.254: U1.P92 43.34,46.26 44.39,45.73 v45.28,45.76
  Bottom 0.254: v45.28,45.76 45.28,44.98 44.88,44.67 44.85,40.23 42.98,37.71 42.98,25.71 41.71,24.64 SV1.2
JPA4  (via drill 0.41)
  Top 0.254: v51.8,50.02 51.19,50.02 50.81,49.36 44.37,49.37 43.7,48.84 42.03,48.84 41.64,49.26 U1.P86
  Bottom 0.254: v51.8,50.02 51.65,49.34 51.62,25.6 52.49,24.7 SV2.2
JPA5  (via drill 0.41)
  Top 0.254: v46.25,53.26 46.21,53.26 U1.P78
  Bottom 0.254: SV1.4 41.84,22.15 44.27,24.37 44.31,24.34 44.33,38.58 46.11,40.7 46.12,52.1 46.25,52.34 v46.26,53.26 v46.25,53.26
JPA6  (via drill 0.41)
  Top 0.254: U1.P95 42.09,44.76 42.72,44.13 46.02,44.13 46.75,45.01 52.11,45.01 52.6,45.38 v52.55,45.38
  Bottom 0.254: v52.55,45.38 52.19,44.66 52.18,40.72 53.13,39.29 53.15,27.91 53.65,26.67 53.64,23.72 52.35,22.21 SV2.4
JPA7  (via drill 0.41)
  Top 0.254: U1.P79 44.1,52.76 44.43,52.36 v45.08,52.35
  Bottom 0.254: v45.08,52.35 45.22,51.58 45.52,51.07 45.52,47.37 44.3,46.41 44.3,40.47 37.98,31.84 37.98,21.23 38.27,20.88 39.98,20.88 41.87,19.63 SV1.6
JPA8  (via drill 0.41)
  Top 0.254: U1.P90 44.81,47.26 45.31,47.74 51.64,47.74 v52.77,46.8
  Bottom 0.254: v52.77,46.8 53.38,45.75 53.37,43.26 54.33,42.39 54.36,22.12 52.32,19.55 SV2.6
JPA9  (via drill 0.41)
  Top 0.254: U1.P94 43.09,45.26 v43.47,45.14
  Bottom 0.254: v43.47,45.14 43.49,40.32 37.43,32.1 37.43,18.99 38.03,18.35 40.2,18.35 41.9,17.08 SV1.8
JPA10  (via drill 0.41)
  Top 0.254: v50.56,46.76 50.59,46.75 U1.P91
  Bottom 0.254: SV2.8 52.38,17.19 51.04,18.94 51.05,45.94 50.56,46.71 v50.56,46.76
JPA11  (via drill 0.41 pad 0.81)
  Top 0.254: U1.P98 42.19,43.26 v42.46,43.26
  Bottom 0.254: v42.46,43.26 42.46,39.92 36.89,32.32 36.88,16.65 37.62,15.86 40.14,15.86 41.9,14.59 SV1.10
JPA12  (via drill 0.41)
  Top 0.254: v53.25,51.66 53.26,51.6 U1.P53
  Bottom 0.254: SV2.10 52.41,14.59 50.72,15.91 48.92,15.9 48.44,16.38 48.44,25.53 50.52,27.15 50.52,44.53 49.6,45.58 49.55,45.63 49.56,49.78 52.02,51.65 53.29,51.66 v53.25,51.66
JPA13  (via drill 0.41)
  Top 0.254: v44.31,50.28 43.93,50.76 U1.P83
  Bottom 0.254: SV1.12 41.95,11.92 40.22,13.26 37.38,13.32 36.34,14.54 36.32,32.54 41.58,39.68 41.55,44.86 44.5,49.28 44.5,49.93 v44.31,50.28
JPA14  (via drill 0.41)
  Top 0.254: U1.P54 52.76,53.71 v52.29,52.96
  Bottom 0.254: v52.29,52.96 51.67,52.87 47.8,50.03 47.8,14.56 48.94,13.32 48.97,13.31 50.77,13.31 52.42,12.03 SV2.12
JPA15  (via drill 0.41)
  Top 0.254: U1.P84 42,50.27 v42.65,49.81
  Bottom 0.254: v42.65,49.81 40.82,47.89 40.85,39.65 35.77,32.91 35.77,12.64 37.36,10.75 40.23,10.7 41.84,9.45 SV1.14
JPA16  (via drill 0.41)
  Top 0.254: U1.P57 51.26,54.78 51.51,54.55 v51.68,54.39
  Bottom 0.254: v51.68,54.39 51.69,53.81 51.67,53.73 47.25,50.43 47.23,12.55 48.82,10.79 50.8,10.79 52.43,9.54 SV2.14
JPA17  (via drill 0.41)
  Top 0.254: U1.P85 38.51,49.76 v38.21,49.52
  Bottom 0.254: v38.21,49.52 38.42,49.53 38,49.39 38,41.45 38.42,40.96 38.45,37.52 35.23,33.14 35.24,10.4 37.22,8.21 40.08,8.18 41.9,6.82 SV1.16
JPA18  (via drill 0.41)
  Top 0.254: U1.P58 50.76,53.7 v47.47,51.64
  Bottom 0.254: v47.47,51.64 46.67,50.99 46.66,10.73 48.66,8.26 50.85,8.26 52.41,6.93 SV2.16
JPB3  (via drill 0.41)
  Top 0.254: U1.P60 49.76,58.02 50.67,58.92 51.47,58.92 52.22,59.68 58.97,59.68 61.21,57.47 v61.91,57.47
  Bottom 0.254: v61.91,57.47 61.59,57.15 61.59,55.24 61.86,54.79 61.86,48 61.09,47.43 61.04,31.15 61.06,30.91 61.06,27.18 63.09,24.77 SV3.2
JPB4  (via drill 0.41)
  Top 0.254: U1.P9 46.26,37.36 46.46,37.08 46.45,34.12 47.85,32.51 73.32,32.53 73.3,32.52 73.95,33.42 v74.6,33.41
  Bottom 0.254: 74.51,33.02 v74.6,33.41 74.5,33.45 74.09,32.97 SV4.2
JPB5  (via drill 0.41)
  Top 0.254: U1.P61 49.26,58.42 50.27,59.46 51.17,59.46 51.92,60.2 59.39,60.2 61.18,58.42 62.87,58.42 v63.65,57.37
  Bottom 0.254: v63.65,57.37 63.62,47.92 61.8,46.75 61.8,28.23 61.95,28.07 64.24,25.65 64.24,23.52 SV3.4
JPB6  (via drill 0.41)
  Top 0.254: U1.P10 46.76,37.82 47.05,37.52 47.05,34.41 48.22,33.21 72.8,33.23 74.33,35.03 | v74.6,35.02 74.34,35.06
  Top 0.406: 74.33,35.03 v74.6,35.02
  Bottom 0.254: SV4.4 72.82,23.22 72.82,33.15 74.57,34.82 v74.6,35.02
JPB7  (via drill 0.41)
  Top 0.254: U1.P2 42.76,32.63 48.21,28.35 v60.08,28.35
  Bottom 0.254: v60.08,28.35 60.48,28.16 60.47,26.82 61.75,25.43 61.75,20.95 SV3.6
JPB8  (via drill 0.41)
  Top 0.254: U1.P11 47.26,38.47 47.62,38.16 47.62,35.02 48.85,33.81 68.25,33.8 68.96,34.22 71.93,34.21 73.33,35.94 v73.28,35.87
  Bottom 0.254: v73.28,35.87 72.78,35.29 70.26,33.48 70.26,21.84 70.92,20.98 72.82,20.98 SV4.6
JPB9  (via drill 0.41 pad 0.81)
  Top 0.254: U1.P3 43.26,32.94 47.4,29.84 57.81,29.85 58.32,30.1 v59.57,31
  Bottom 0.254: SV3.8 61.42,18.44 59.41,18.44 58.53,19.32 58.52,29.62 v59.57,31
JPB10  (via drill 0.41)
  Top 0.254: v73.05,37.7 71.13,37.71 70.77,38.01 65.95,38.01 65.44,38.73 59.27,38.73 57.9,36.4 51.41,36.4 50.27,37.51 50.27,38.26 49.77,38.79 49.77,40.37 U1.P16
  Bottom 0.254: v73.05,37.7 73.1,36.96 72.29,36.65 72.29,35.68 69.7,33.82 69.69,19.79 71.04,18.39 73,18.39 74.12,17.14 SV4.8
JPB11  (via drill 0.41)
  Top 0.254: U1.P4 43.76,33.39 46.9,31.03 56.74,31.04 v57.61,30.96
  Bottom 0.254: v57.61,30.96 57.87,30.19 57.86,16.99 59.07,15.99 61.47,16 SV3.10
JPB12  (via drill 0.41)
  Top 0.254: v71.63,38.55 66.38,38.55 65.83,39.37 58.93,39.37 57.51,37.06 51.6,37.07 50.82,37.85 50.82,38.57 50.27,39.09 50.3,40.42 U1.P17
  Bottom 0.254: SV4.10 72.79,15.88 70.46,15.88 68.99,17.63 68.99,33.99 71.7,35.91 v71.63,38.55
JPB13  (via drill 0.41)
  Top 0.254: U1.P22 52.78,39.12 53.14,38.79 55.07,38.76 55.7,39.37 57.15,39.4 v57.6,39.05
  Bottom 0.254: v57.6,39.05 57.35,38.3 56.66,37.39 56.66,29.02 57.1,28.35 57.08,28.28 57.06,14.15 58.29,13.26 61.62,13.26 SV3.12
JPB14  (via drill 0.41)
  Top 0.254: v67.91,29.29 66.78,29.3 65.76,27.48 v55.95,27.48 | v56.05,38.2 56.06,38.18 55.4,37.77 51.77,37.76 51.35,38.23 51.35,38.9 50.77,39.32 50.77,40.45 U1.P18
  Bottom 0.254: SV4.12 72.8,13.37 70.46,13.36 67.49,17.23 67.49,28.47 67.92,28.83 v67.91,29.29 | v55.95,27.48 55.95,37.65 v56.05,38.19 v56.05,38.2
JPB15  (via drill 0.41)
  Top 0.254: U1.P23 53.26,39.52 53.49,39.37 54.85,39.37 55.56,40.01 61.28,40.01 61.59,40.32 v65.03,40.32
  Bottom 0.254: v65.03,40.32 65.03,39.18 63.86,38.63 63.86,27.13 64.84,26.01 64.85,10.95 SV3.14
JPB16  (via drill 0.41)
  Top 0.254: U1.P12 47.76,38.92 48.18,38.61 48.18,35.55 49.29,34.52 67.96,34.54 v69.18,35.24
  Bottom 0.254: SV4.14 72.52,10.82 70.36,10.82 66.83,15.18 66.82,33.77 69.18,34.8 v69.18,35.24
JPB17  (via drill 0.41)
  Top 0.254: U1.P5 44.26,33.84 46.91,31.8 64.49,31.79 v64.94,31.05
  Bottom 0.254: v64.94,31.05 65.32,30.5 65.48,30.02 65.48,8.81 SV3.16
JPB18  (via drill 0.41)
  Top 0.254: U1.P15 49.26,36.48 49.85,35.89 58.34,35.89 59.61,38.1 65.12,38.1 65.8,37.15 v68.22,37.15
  Bottom 0.254: SV4.16 72.49,8.31 70.13,8.31 66.21,13.23 66.21,35.49 68.27,36.46 68.21,36.38 68.29,37.18 v68.22,37.15
LED0  (via drill 0.41)
  Top 0.254: U1.P70 44.76,58.43 v44.16,58.88 | v43.81,87.31 R11.1
  Bottom 0.254: v44.16,58.88 43.8,59.23 43.81,61.02 v43.81,87.31
LED1  (via drill 0.41)
  Top 0.254: U1.P71 44.26,57.53 43,58.74 v42.93,60.36 | v42.93,84.44 42.95,85.85 47,87.81 46.99,88.9 R12.1
  Bottom 0.254: v42.93,60.36 42.98,60.55 42.94,61.53 v42.93,84.44
LED2  (via drill 0.41)
  Top 0.254: U1.P62 48.76,58.83 49.99,60.03 50.95,60.02 52.25,61.29 v52.86,61.25 | v50.8,87.82 R13.1
  Bottom 0.254: v52.86,61.25 52.17,62.1 52.17,85.6 50.8,86.36 v50.8,87.82
LED3  (via drill 0.41)
  Top 0.254: U1.P66 46.76,60.48 47.31,61.02 v47.69,61.45 | v48.26,87.31 48.58,87.31 48.92,86.92 51.46,86.92 52.07,87.63 R14.1
  Bottom 0.254: v47.69,61.45 47.68,73.88 46.22,75.48 46.22,85.08 48.26,86.36 v48.26,87.31
LED4  (via drill 0.41)
  Top 0.254: U1.P67 46.26,59.15 46.25,60.91 v46.15,61.47 | R15.1 54.61,88.27 52.63,86.36 48.08,86.36 47.31,86.68 v46.85,86.73
  Bottom 0.254: v46.15,61.47 46.13,73.8 45.48,74.5 45.48,85.19 46.8,86.23 v46.85,86.73
LED5  (via drill 0.41)
  Top 0.254: U1.P68 45.76,59.97 v44.77,60.66 | R16.1 57.15,87.95 56.52,87.31 54.93,87.31 53.34,85.83 v44.76,85.83
  Bottom 0.254: v44.77,60.66 v44.76,85.83
LED6  (via drill 0.41)
  Top 0.254: U1.P63 48.26,59.14 50.52,61.38 v51.03,61.42 | R17.1 59.69,88.58 57.78,86.68 55.56,86.68 53.66,84.77 49.08,84.78 48.88,85.1 v48.78,84.95
  Bottom 0.254: v48.78,84.95 48.77,77.04 50.04,75.78 50.04,62.74 50.7,62.03 v51.03,61.42
LED7  (via drill 0.41)
  Top 0.254: U1.P65 47.26,59.46 v49.25,61.45 | R18.1 62.23,88.27 61.28,87.31 59.69,87.31 58.42,86.04 56.2,86.04 54.27,84.04 47.92,84.04 v47.24,84.48
  Bottom 0.254: v49.25,61.45 49.26,74.83 47.24,76.77 v47.24,84.48
M1+M2  (via drill 0.41, 0.6)
  Top 0.254: U1.P39 54.74,48.76 54.61,48.9 54.61,50.08 54.8,50.26 55.93,50.26 55.94,50.26 U1.P42 58.92,50.26 v59.58,50 59.59,49.96 | IC2.P$29 63.25,67.89 v63.25,70.8 | v63.98,84.18 R33.2
  Top 0.305: v63.25,70.8 63.25,70.87 | v59.58,50 59.59,49.99 R31.1
  Bottom 0.254: v59.58,50 60.49,51.35 60.75,51.73 60.75,54.14 60.33,54.61 60.33,60.96 60.01,61.28 60.01,62.23 61.61,63.99 61.62,69.08 v63.25,70.8 63.22,70.79 63.22,77.27 63.98,78.36 v63.98,84.18
MOSI/CSI_B  (via drill 0.41)
  Top 0.254: IC2.P$13 63.75,59.82 v64.51,59.02 | U1.P27 62.45,42.76 62.87,43.18 v63.18,43.18 | IC2.P$30 62.75,67.86 62.75,69.72 62.23,70.23 62.23,72.39 63.88,72.39 | v66.89,72.53 66.95,72.44
  Top 0.305: 63.88,72.39 IC4.1 63.92,72.39 65.86,72.36 66.47,72.36 66.95,72.44
  Bottom 0.254: v64.51,59.02 64.52,55.62 64.19,55.12 64.19,47.4 63.18,46.67 v63.18,43.18 | v65.85,77.14 65.86,76.34 66.87,75.76 66.89,73.9 v66.89,72.53 | 65.28,63.08 65.3,67.89 | 64.53,59.05 64.51,62.29
  Bottom 0.305: 65.3,67.89 66.89,69.28 v66.89,72.53 | 64.51,62.29 65.28,63.08 | v64.51,59.02 64.53,59.05
N$1
  Top 0.305: R11.2 LED0.A
N$2
  Top 0.305: R12.2 LED1.A
N$3
  Top 0.254: U1.P48 57.68,53.26 58.4,54.33 59.18,54.33
  Top 0.305: 59.18,54.33 R30.1
N$4
  Top 0.254: R26.2 LED9.C
N$5
  Top 0.406: R22.1 78.73,82.01 79.15,81.33 81.92,81.33 P1.D+
N$6  (via drill 3.17 pad 6.45)
  other vias: 3.8,92.72
N$7
  Top 0.406: 83.46,86.3 86.41,86.3
N$8
  Top 0.406: R23.2 78.69,79.96 79.05,80.54 82.07,80.54 P1.D-
N$9
  Top 0.305: R13.2 LED2.A
N$10
  Top 0.305: R14.2 LED3.A
N$11
  Top 0.305: R15.2 LED4.A
N$12
  Top 0.305: R16.2 LED5.A
N$13
  Top 0.305: R17.2 LED6.A
N$14
  Top 0.305: 62.23,92.61 LED7.A R18.2
N$15
  Top 0.305: LED8.A 34.34,61.59 R19.2
N$16  (via drill 3.17 pad 6.45)
  other vias: 87.65,3.82
N$17
  Top 0.254: 28.9,44.14 28.89,44.13 | IC3.2 28.9,44.14 | 28.9,44.14 29.53,44.14 IC3.1 29.56,44.14 29.26,44.43
  Top 0.61: 27.15,50.37 R10.1 | R27.2
  Top 1.016: 27.15,50.37 27.15,49.15 28.79,47.62 C5.+ 29.6,45.77 29.6,44.76 29.26,44.43 | R10.1 27.15,51.59 R27.2
N$18
  Top 0.254: IC1.17 82.62,45.34 83.19,44.77 83.5,44.77 83.82,44.45 C2.1
N$19
  Top 0.254: D3.A 82.62,18.68 82.62,21.97 81.45,22.59 R21.2 81.27,23.64 80,25.24 JP5.3
N$20  (via drill 0.5)
  Top 0.254: v72.54,79.93 72.54,79.96 R23.1
  Top 0.305: IC1.16 79.78,44.68 v80.37,44.4
  Bottom 0.254: v80.37,44.4 80.77,45.64 80.77,48.06 81.38,48.97 81.38,75.34 75.84,79.07 73.76,79.07 | 73.53,79.1 73.41,79.22 | 73.41,79.22 73.2,79.43 | 73.41,79.22 v72.54,79.93
  Bottom 0.305: 73.76,79.07 73.53,79.1
N$22
  Top 1.016: C10.1 8.89,22.54 R25.2 7.49,22.41 6.99,21.91 6.99,14.92 7.3,14.29 9.53,14.29 9.84,13.97 9.88,14.01 REG3.IP
N$23  (via drill 3.17 pad 6.45)
  other vias: 3.82,3.81
N$24
  Top 1.016: X3.2 5.4,81.28 8.26,79.38 8.29,79.42 D1.~1
N$25
  Top 1.016: D1.~2 13.29,79.65 13.34,79.69 13.34,84.77 11.35,86.81 5.38,86.82 5.44,85.24 X3.1
N$26
  Top 0.254: 73.48,62.89 R2.2 | IC2.P$17 65.91,61.85 66.4,61.21 72.19,61.21 73.48,62.89 | 73.48,62.89 C1.1
N$27
  Top 0.254: JP4.3 80.03,31.46 80.37,31.76 R8.2 81.64,33.46 81.62,37.23 80.5,38.13 D2.A
N$28
  Top 0.254: JP6.3 78.59,27.02 78.59,23.08 78.71,22.68 R24.2 78.68,22.84 80,21.91 80,18.71 78.8,17.48 D4.A
N$29
  Top 0.305: 20.83,83.69 22.15,83.69
N$34
  Top 0.406: 86.8,90.42 86.82,85.65 86.82,76.43 82.86,76.43
N$35  (via drill 2.54 pad 2.54)
  other vias: 9.84,82.87
N$36
  $GND 0: 1.02,95.51 90.43,95.51 90.43,1.02 1.02,1.02 1.02,95.51
NDONELED
  Top 0.254: IC2.P$10 62.25,60.66 61.91,60.33 60.99,60.33 59.48,61.89 53.72,61.89 53.11,62.48 38.28,62.46 37.47,61.59 R19.1
PB1  (via drill 0.41)
  Top 0.254: U1.P30 57.34,44.26 v57.52,44.37 | v58.42,84.45 57.15,84.45 55.56,82.84 40.77,82.84 39.29,84.31 31.51,84.31 30.16,87.31 29.53,87.31 | S2.4 29.24,89.19 29.21,89.22 29.18,89.19 S2.3 | 29.53,87.31 26.77,87.31 | 29.53,87.31 29.53,89.22
  Top 0.305: 26.77,87.31 R6.1 | 29.53,89.22 29.4,89.22 S2.4
  Bottom 0.254: v57.52,44.37 58.62,46.32 58.62,52.63 | v58.42,84.45 58.5,83.62 58.52,58.73 58.52,58.7 58.52,57.71 | 58.42,52.98 58.42,57.53
  Bottom 0.305: 58.62,52.63 58.42,52.98 | 58.42,57.53 58.52,57.71
PB2  (via drill 0.41)
  Top 0.254: U1.P69 45.26,59.2 43.97,60.08 43.61,61.14 43.17,61.28 v39.05,61.28 | v39.32,83.06 26.63,83.03 24.07,87.3 17.73,87.3 17.73,87.31 15.24,87.31 | S3.3 10.13,89.19 10.16,89.22 10.19,89.19 S3.4 | 17.78,89.03 17.78,87.31
  Top 0.305: 15.56,87.31 R7.1 15.24,87.31 | 17.78,87.31 17.73,87.31 | S3.4 17.78,89.03
  Bottom 0.254: v39.05,61.28 39.05,61.91 39.33,62.22 v39.32,83.06
PROG_B  (via drill 0.41)
  Top 0.254: v37.41,39.84 39.95,39.83 40.88,40.53 U1.P1 | IC2.P$8 60.32,63.02 59.75,62.45 54.17,62.45 53.26,63.36 v40.96,63.36 | 36.51,69.88 S4.4 | 36.51,69.88 S4.3 | v40.96,65.72 40.96,67.31 40.64,67.63 39.05,67.63 | 39.05,67.63 R5.1 | 39.05,67.63 37.15,67.63 36.51,68.26 36.51,69.88
  Bottom 0.254: v37.41,39.84 37.42,53.71 38.42,54.61 38.42,55.56 40.96,58.1 v40.96,63.36 v40.96,65.72
PWREN#  (via drill 0.5)
  Top 0.254: IC1.12 v73.36,45.34 | v73.08,58.37 v67.36,58.37 | v67.33,62.15 66.57,63.52 IC2.P$18
  Bottom 0.254: v73.36,45.34 73.08,46.25 v73.08,58.37 | v67.36,58.37 67.31,59.03 v67.33,62.15
RD#/M0  (via drill 0.41)
  Top 0.254: U1.P43 57.58,50.76 58.34,51.56 59.13,51.56 59.36,51.34 60.45,51.34 61.48,52.38 63.4,52.38 64.11,53.08 65.18,53.08 v65.14,53.07 65.56,53.08 66.26,53.27 R32.1 | IC1.13 70.34,44.69 69.8,44.03 65.33,44.03 64.77,44.45 v64.45,44.45 | R34.1 72.75,66.75 72.74,66.75 72.74,66.74 | IC2.P$23 67.84,66.01 68.56,66.73 69.95,66.73 | 69.95,66.73 69.93,66.74 v69.89,66.74 72.74,66.74 | 69.95,66.73 69.93,66.7 | 72.74,66.74 72.74,66.72
  Bottom 0.254: v64.45,44.45 64.45,45.09 64.72,45.45 64.72,52.6 v65.14,53.07 | 65.71,53.31 67.61,53.31 68.2,53.82 68.26,53.95 68.25,65.25 69.99,66.08 69.9,66.75 v69.89,66.74
  Bottom 0.305: v65.14,53.07 65.71,53.31
RDWR_B  (via drill 0.41)
  Top 0.254: v57.59,67.45 56.9,66.8 56.9,65.72 | 56.9,65.72 56.9,65.41 56.9,65.4 57.79,64.5 61.08,64.5 IC2.P$5 | U1.P38 57.47,48.26 v57.75,48.14 | R9B.1 56.36,65.96 56.9,65.72
  Bottom 0.254: v57.75,48.14 57.17,48.62 57.15,50.48 57.61,51.22 57.61,53.12 57.8,53.57 57.81,63.36 55.96,65.1 55.96,66.88 57.66,67.31
  Bottom 0.305: 57.66,67.31 v57.59,67.45
RXF  (via drill 0.41)
  Top 0.254: U1.P89 44.3,47.76 44.91,48.34 52.08,48.34 53.34,47.62 v54.29,46.35 | v60.13,37.15 62.23,37.15 62.55,37.47 64.77,37.47 65.71,36.2 71.98,36.2 72.62,36.83 75.33,36.84 76.22,37.6 v76.22,37.65 | 84.68,64.64 77.32,64.64 75.87,67.03 74.7,67.03 73.66,65.76 69.01,65.76 68.67,65.52 IC2.P$22
  Top 0.305: v84.43,64.78 84.68,64.64 | v84.45,49.24 84.48,49.23 IC1.23
  Bottom 0.254: v54.29,46.35 54.99,46.48 58.55,40.82 58.57,38.15 v60.13,37.15 | v84.43,64.78 v84.45,49.24 84.47,49.25 | 84.47,49.25 84.47,49.27 | 84.47,49.25 84.46,43.33 84.03,42.84 77.09,42.83 76.62,42.34 76.62,38.27 76.22,37.6 v76.22,37.65
SHDN  (via drill 0.5)
  Top 0.254: v34.95,81.2 55.19,81.18 55.75,81.58 56.41,81.58 57.05,82.19 70.03,82.19 v70.03,82.14 | v75.29,66.02 75.44,65.58 75.51,64.57 R2.1 | 28.25,45.01 v28.32,45.34 28.23,44.98 IC3.3
  Bottom 0.254: v28.32,45.34 31.67,47.93 34.27,47.93 34.95,48.62 v34.95,81.2 | v70.03,82.14 70.89,81.05 70.87,77.72 75.51,74.6 75.51,66.6 v75.29,66.02
TCK  (via drill 0.41)
  Top 0.254: IC2.P$16 65.25,62.26 65.25,61.11 65.86,60.58 76.05,60.58 76.33,61.24 v76.42,61.66
  Bottom 0.254: v76.42,61.66 76.42,68.19 76.71,68.5 JP2.4
TCK_FPGA
  Top 0.254: JP3.4 34.92,49.21 35.24,49.53 35.24,52.39 34.61,53.02 31.11,53.02 30.8,53.34 30.8,55.24 31.11,55.56 34.61,55.56 35.56,54.61 39.05,54.61 39.37,54.29 39.37,53.98 39.59,53.76 U1.P77
TDI
  Top 0.254: JP2.2 80.7,63.42 81.33,62.79 81.41,62.74 81.41,60.15 80.57,59.36 65.3,59.36 64.24,60.35 IC2.P$14
TDI_FPGA
  Top 0.254: U1.P100 37.5,42.26 37.15,41.91 35.56,41.91 33.34,44.13 JP3.2
TDO
  Top 0.254: IC2.P$25 65.25,67.94 66.3,68.86 66.28,68.85 75.67,68.83 78.87,65.81
  Top 0.305: 78.87,65.81 JP2.3
TDO_FPGA  (via drill 0.41)
  Top 0.254: U1.P76 39.72,55.25 37.15,55.24 36.83,55.56 v35.88,55.56
  Bottom 0.254: v35.88,55.56 35.76,55.19 35.76,46.94 35.24,46.67 JP3.3
TMS
  Top 0.254: IC2.P$15 64.75,60.66 65.52,59.94 78.47,59.94 78.74,60.64 JP2.1
TMS_FPGA  (via drill 0.41)
  Top 0.254: U1.P75 38.02,55.96 v37.15,56.77
  Bottom 0.254: v37.15,56.77 37.15,55.24 36.3,54.5 36.3,44.04 35.43,43.55 35.41,41.96 35.06,41.59 JP3.1
TXE#  (via drill 0.41)
  Top 0.254: U1.P88 43.96,48.26 44.6,48.86 52.76,48.86 v53.34,48.68 | v55.25,61.1 59.38,61.1 61.4,59.05 | IC1.22 77.78,48.59 76.8,49.21 75.11,49.21 v74.61,49.53
  Top 0.305: 73.28,57.4 v74.59,57.34 73.41,57.4 64.64,57.4 63.48,59.05 61.4,59.05
  Bottom 0.254: v53.34,48.68 54.59,48.68 55.22,49.31 55.24,55.59 55.91,56.37 55.91,57.73 55.25,58.49 v55.25,61.1 | v74.59,57.34 74.92,56.71 74.92,50.43 v74.61,49.53
USB+  (via drill 0.41)
  Top 0.254: IC1.15 78.56,43.68 79.17,43.42 81.08,43.42 v81.83,44.09
  Top 0.305: 73.39,82.04 72.29,81.99 | v72.57,82.06 73.39,82.04 | R22.2 73.39,82.04
  Bottom 0.254: v81.83,44.09 81.71,43.99 82.75,45.36 82.75,68.81 82.17,69.67 82.17,77.27 76.58,81.03 73.51,81.03 72.59,82.04 v72.57,82.06
V+
  Top 1.016: D1.+ 8.29,69.81 9.53,68.43 | 9.53,68.43 9.53,65.09 9.65,65.09 | 10.2,65.05 10.16,65.09 9.65,65.09 | 9.53,68.43 C7.1 | 9.65,65.09 9.65,64.87 9.31,64.87 REG1.IP
VBUS
  Top 0.305: 84.4,72.21 C6.1 84.18,72.29 82.94,72.29 78.66,76.58 78.66,78.18
  Top 0.406: 78.59,78.18 78.59,78.15 | 81.89,79.68 P1.VBUS
  Top 0.61: 78.59,78.15 79.61,79.68 79.7,79.68 81.89,79.68
  Top 0.813: L1.2 78.59,78.18 78.66,78.18
VCC  (via drill 0.5)
  Top 0.254: IC2.P$19 66.86,64.02 v67.4,63.84 | v67.73,83.05 67.33,82.98 56.79,82.98 55.91,82.14 26.16,82.14 24.05,85.37 20.04,85.37 19.05,84.56 JP1.2
  Top 0.61: 19.05,76.83 LED9.A | JP1.2 20.65,82.83 20.65,83.67 JP2USB.2
  Top 1.016: 6.99,32.07 6.99,26.04 7.81,25.21 R25.1 10.98,25.21 12.06,24.13 15.24,24.13 17.14,22.23 35.41,22.23 36.6,21.01 36.61,17.09 | 6.99,32.07 6.99,40.01 7.94,40.64 8.89,40.64 | 8.89,40.64 C3.1 | 8.89,40.64 8.86,40.67 C34.+ 8.86,45.12 4.76,49.21 4.78,51.71 R27.1 | REG2.IP 6.95,33.06 6.99,32.07 | R20.1 19.05,76.83 JP1.2 | 36.61,17.09 36.61,16.92 36.57,6.88 36.57,6.81 | 36.57,6.81 36.58,2.68 47.22,2.71 | 47.22,2.71 57.82,2.71 | 57.82,2.71 68.9,2.73 | 47.22,2.71 47.2,6.96 | 47.2,6.96 47.22,17.14 47.2,17.17 SV2.7 | SV4.7 68.89,17.17 68.89,7.04 | 68.9,2.73 68.89,7.04 | 68.89,7.04 SV4.15 | SV3.7 57.82,17.17 57.82,7.04 | 57.82,2.71 57.82,7.04 | 57.82,7.04 57.86,7.04 SV3.15 | 47.2,6.96 47.2,7 SV2.15 | 68.9,2.73 77.07,2.73 77.08,8.59 78.22,9.39 85.1,9.39 86.13,10.86 86.13,19.42 84.44,20.4 84.37,21.79 | 36.61,17.09 36.63,17.12 SV1.7 | 36.57,6.81 36.58,6.96 SV1.15 | 84.37,21.79 C37.1 | 84.37,21.79 82.62,23.85 82.62,25.21 JP5.2 82.59,27.85 JP6.2 82.59,30.5 JP4.2 82.57,31.14 84.1,32.53 C35.1
  Bottom 0.254: v67.4,63.84 67.73,64.41 v67.73,83.05
  Bottom 1.016: JP1.2 19.07,57.96 4.83,52.48 R27.1
WR/VS2  (via drill 0.41)
  Top 0.254: U1.P47 59,52.76 59.45,53.15 60.55,53.15 60.81,53.01 63.2,53.01 64.61,54.73 70.24,54.73 v70.29,54.74 | IC1.14 71.31,44 v71.35,42.67 71.77,42.86 R6B.1
  Bottom 0.254: v70.29,54.74 70.29,49.02 70.31,48.32 70.31,43.56 v71.35,42.67

## Text on the board
Top: BB4 Rev. A (c) Demand Peripherals Inc. 2008
$GND: BB4 Rev. A (c) Demand Peripherals Inc. 2008
Vxx: BB4 Rev. A (c) Demand Peripherals Inc. 2008
Bottom: BB4 Rev. A (c) Demand Peripherals Inc. 2008
tPlace: BB4 Rev. A (c) Demand Peripherals Inc. 2008
tNames: 3V3 | GND | TCK | TDO | TDI | TMS | 3V3 | GND | TCK | TDO | TDI | TMS | BB4 Rev. A (c) Demand Peripherals Inc. 2008
tValues: BB4 Rev. A (c) Demand Peripherals Inc. 2008
bValues: 20 | 20
tStop: BB4 Rev. A (c) Demand Peripherals Inc. 2008
bStop: BB4 Rev. A (c) Demand Peripherals Inc. 2008
tCream: BB4 Rev. A (c) Demand Peripherals Inc. 2008
Drills: BB4 Rev. A (c) Demand Peripherals Inc. 2008
Holes: BB4 Rev. A (c) Demand Peripherals Inc. 2008
Document: BB4 Rev. A (c) Demand Peripherals Inc. 2008
Name: 3 | 3 | 3 | 3 | 3 | 3 | 2 | 3 | 3 | 3 | 3 | 2 | 3 | 1 | 3 | 2 | 3 | 1 | 3 | 2 | 3 | 3 | 3 | 1 | 3 | 3 | 2 | 3 | 3 | 2 | 3 | 2 | 3 | 3 | 3 | 3 | 1 | 1 | 3 | 1 | 2 | 3 | 1 | 2 | 3 | 3 | 2 | 2 | 2 | 3